# EAGLE design V0.2 (EAGLE 8.6.2)

## Sheet 1 of 4
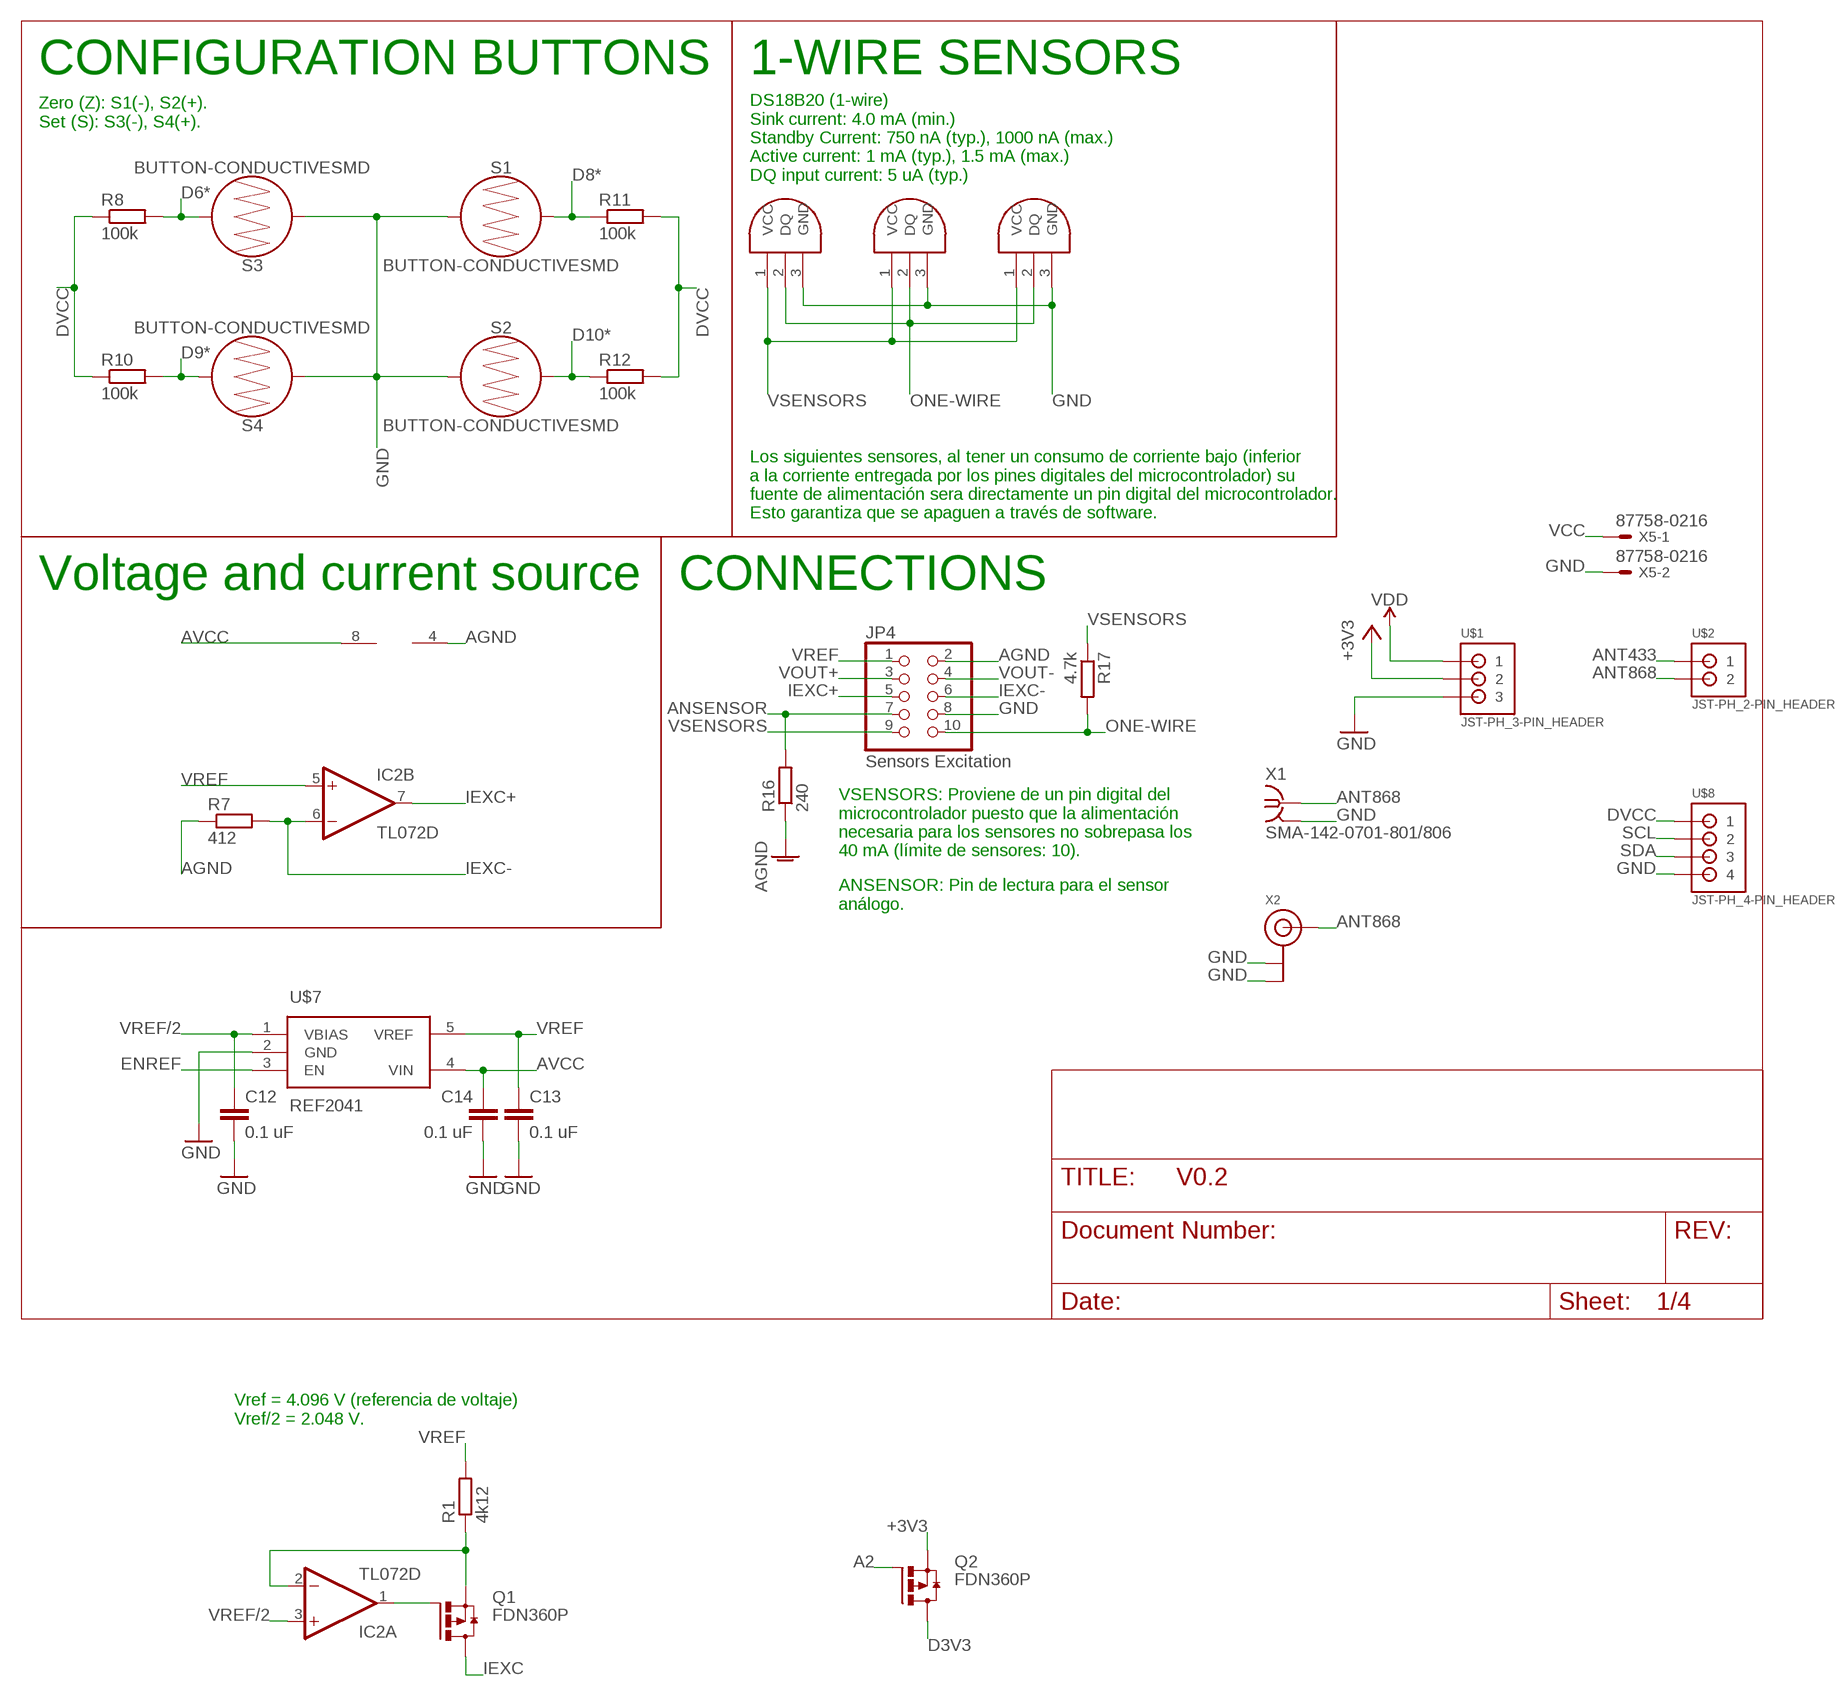
[diagram p0: schematic, sheet 1]

### Parts
C12  0.1 uF  C-EUC0805  [C0805]
C13  0.1 uF  C-EUC0805  [C0805]
C14  0.1 uF  C-EUC0805  [C0805]
IC2  TL072D  [SO08]
JP4  Sensors Excitation  PINHD-2X5/90  [2X05/90]
Q1  FDN360P  [SUPER-SOT3]
Q2  FDN360P  [SUPER-SOT3]
R1  4k12  R-EU_R0805  [R0805]
R7  412  R-EU_R0805  [R0805]
R8  100k  R-EU_R0805  [R0805]
R10  100k  R-EU_R0805  [R0805]
R11  100k  R-EU_R0805  [R0805]
R12  100k  R-EU_R0805  [R0805]
R16  240  R-EU_R0805  [R0805]
R17  4.7k  R-EU_R0805  [R0805]
S1  BUTTON-CONDUCTIVESMD  [BUTTON-CONDUCTIVE]
S2  BUTTON-CONDUCTIVESMD  [BUTTON-CONDUCTIVE]
S3  BUTTON-CONDUCTIVESMD  [BUTTON-CONDUCTIVE]
S4  BUTTON-CONDUCTIVESMD  [BUTTON-CONDUCTIVE]
U$1  JST-PH_3-PIN_HEADER  [JST_B3B-PH_HEADER]
U$2  JST-PH_2-PIN_HEADER  [JST_B2B-PH_HEADER]
U$5  DS18B20_PINS  [3PINS_SMALL]
U$6  DS18B20_PINS  [3PINS_SMALL]
U$7  REF2041  [SOT(5)]
U$8  JST-PH_4-PIN_HEADER  [JST_B4B-PH_HEADER]
U$9  DS18B20_PINS  [3PINS_SMALL]
X1  SMA-142-0701-801/806  [J502-ND-142-0701-801/806]
X2  ANTENNA_U.FL  [U.FL]
X5  87758-0216  [87758-0216]

### Nets
+3V3 [power]: Q2.2(S) U$1.P2 ; also sheet 2,3,4
A2: Q2.1(G) ; also sheet 2
AGND: IC2.4(P:V-) JP4.2 R7.1 R16.1 ; also sheet 4
ANSENSOR: JP4.7 R16.2 ; also sheet 2
ANT433: U$2.P1 ; also sheet 3
ANT868: U$2.P2 X1.1 X2.3(SIGNAL) ; also sheet 3
AVCC: C14.1 IC2.8(P:V+) U$7.4(VIN) ; also sheet 2,4
D3V3: Q2.3(D)
D6*: R8.2 S3.2 ; also sheet 2
D8*: R11.1 S1.2 ; also sheet 2
D9*: R10.2 S4.2 ; also sheet 2
D10*: R12.1 S2.2 ; also sheet 2
DVCC: R8.1 R10.1 R11.2 R12.2 U$8.P1 ; also sheet 2,3,4
ENREF: U$7.3(EN) ; also sheet 2
GND [power]: C12.2 C13.2 C14.2 JP4.8 S1.1 S2.1 S3.1 S4.1 U$1.P3 U$5.3(GND) U$6.3(GND) U$7.2(GND) U$8.P4 U$9.3(GND) X1.G@1 X1.G@2 X1.G@3 X1.G@4 X2.1(GND) X2.2(GND) X5.2 ; also sheet 2,3,4
IEXC: Q1.3(D)
IEXC+: IC2.7(B:OUT) JP4.5
IEXC-: IC2.6(B:-IN) JP4.6 R7.2
N$2: IC2.1(A:OUT) Q1.1(G)
ONE-WIRE: JP4.10 R17.2 U$5.2(DQ) U$6.2(DQ) U$9.2(DQ) ; also sheet 2
SCL: U$8.P2 ; also sheet 2
SDA: U$8.P3 ; also sheet 2
VCC [power]: X5.1 ; also sheet 4
VDD [power]: U$1.P1 ; also sheet 4
VEXC: IC2.2(A:-IN) Q1.2(S) R1.1
VOUT+: JP4.3 ; also sheet 2
VOUT-: JP4.4 ; also sheet 2
VREF: C13.1 IC2.5(B:+IN) JP4.1 R1.2 U$7.5(VREF)
VREF/2: C12.1 IC2.3(A:+IN) U$7.1(VBIAS)
VSENSORS: JP4.9 R17.1 U$5.1(VCC) U$6.1(VCC) U$9.1(VCC) ; also sheet 2

### Notes on the sheet
- CONFIGURATION BUTTONS | 1-WIRE SENSORS
- Zero (Z): S1(-), S2(+).
  Set (S): S3(-), S4(+).
- DS18B20 (1-wire)
  Sink current: 4.0 mA (min.)
  Standby Current: 750 nA (typ.), 1000 nA (max.)
  Active current: 1 mA (typ.), 1.5 mA (max.)
  DQ input current: 5 uA (typ.)
- Los siguientes sensores, al tener un consumo de corriente bajo (inferior 
  a la corriente entregada por los pines digitales del microcontrolador) su 
  fuente de alimentación sera directamente un pin digital del microcontrolador. 
  Esto garantiza que se apaguen a través de software.
- Voltage and current source | CONNECTIONS
- VSENSORS: Proviene de un pin digital del 
  microcontrolador puesto que la alimentación
  necesaria para los sensores no sobrepasa los 
  40 mA (límite de sensores: 10).
- ANSENSOR: Pin de lectura para el sensor 
  análogo.
- Vref = 4.096 V (referencia de voltaje)
  Vref/2 = 2.048 V.

## Sheet 2 of 4: This sheet contain all the configuration neccesary for microcontroller ATmega32u4. All conections about source, reset and external clocks was included here.
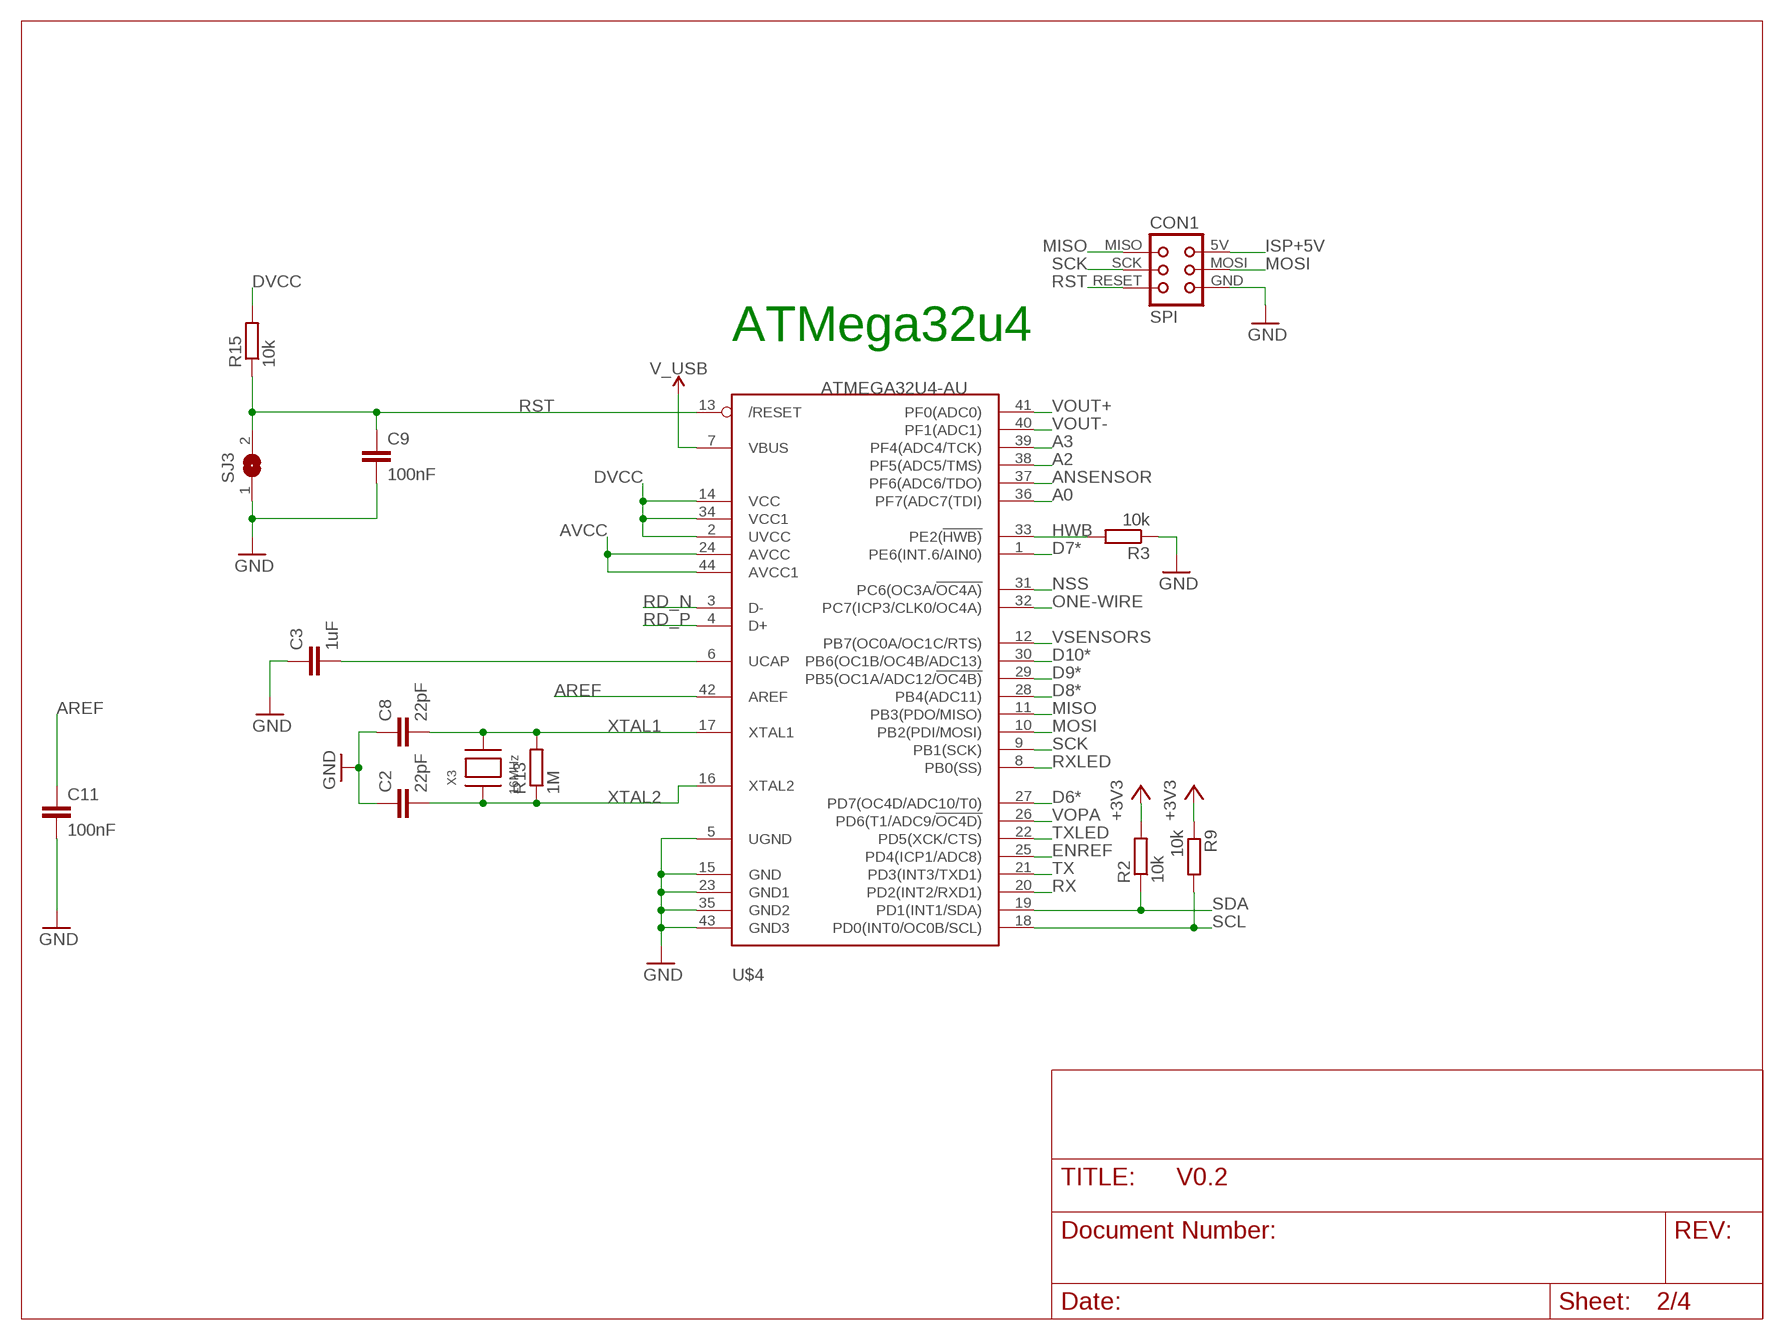
[diagram p1: schematic, sheet 2]

### Parts
C2  22pF  C-EUC1206  [C1206]
C3  1uF  C-EUC1206  [C1206]
C8  22pF  C-EUC1206  [C1206]
C9  100nF  C-EUC1206  [C1206]
C11  100nF  C-EUC1206  [C1206]
CON1  SPI  TINYISPT  [TC2030-MCP-NL]
R2  10k  R-EU_M1206  [M1206]
R3  10k  R-EU_M1206  [M1206]
R9  10k  R-EU_M1206  [M1206]
R13  1M  R-EU_R1206  [R1206]
R15  10k  R-EU_M0805  [M0805]
SJ3  SJ  [SJ]
U$4  ATMEGA32U4-AU  [TQFP44]
X3  16MHz  XTALNX6035  [NX6035]

### Nets
+3V3 [power]: R2.2 R9.1 ; also sheet 1,3,4
A0: U$4.36(PF7(ADC7(TDI))
A2: U$4.38(PF5(ADC5/TMS)) ; also sheet 1
A3: U$4.39(PF4(ADC4/TCK))
ANSENSOR: U$4.37(PF6(ADC6/TDO)) ; also sheet 1
AREF: C11.1 U$4.42(AREF)
AVCC: U$4.24(AVCC) U$4.44(AVCC1) ; also sheet 1,4
D6*: U$4.27(PD7(OC4D/ADC10/T0)) ; also sheet 1
D7*: U$4.1(PE6(INT.6/AIN0))
D8*: U$4.28(PB4(ADC11)) ; also sheet 1
D9*: U$4.29(PB5(OC1A/ADC12/!OC4B)) ; also sheet 1
D10*: U$4.30(PB6(OC1B/OC4B/ADC13)) ; also sheet 1
DVCC: R15.2 U$4.2(UVCC) U$4.14(VCC) U$4.34(VCC1) ; also sheet 1,3,4
ENREF: U$4.25(PD4(ICP1/ADC8)) ; also sheet 1
GND [power]: C2.1 C3.1 C8.1 C9.2 C11.2 CON1.GND R3.1 SJ3.1 U$4.5(UGND) U$4.15(GND) U$4.23(GND1) U$4.35(GND2) U$4.43(GND3) ; also sheet 1,3,4
HWB: R3.2 U$4.33(PE2(!HWB))
ISP+5V [power]: CON1.5V(VCC) ; also sheet 4
MISO: CON1.MISO U$4.11(PB3(PDO/MISO)) ; also sheet 3
MOSI: CON1.MOSI U$4.10(PB2(PDI/MOSI)) ; also sheet 3
NSS: U$4.31(PC6(OC3A/!OC4A)) ; also sheet 3
ONE-WIRE: U$4.32(PC7(ICP3/CLK0/OC4A)) ; also sheet 1
RD_N: U$4.3(D-) ; also sheet 4
RD_P: U$4.4(D+) ; also sheet 4
RST: C9.1 CON1.RESET R15.1 SJ3.2 U$4.13(/RESET) ; also sheet 3
RX: U$4.20(PD2(INT2/RXD1)) ; also sheet 3
RXLED: U$4.8(PB0(SS))
SCK: CON1.SCK U$4.9(PB1(SCK)) ; also sheet 3
SCL: R9.2 U$4.18(PD0(INT0/OC0B/SCL)) ; also sheet 1
SDA: R2.1 U$4.19(PD1(INT1/SDA)) ; also sheet 1
TX: U$4.21(PD3(INT3/TXD1)) ; also sheet 3
TXLED: U$4.22(PD5(XCK/CTS))
UCAP: C3.2 U$4.6(UCAP)
V_USB [power]: U$4.7(VBUS) ; also sheet 4
VOPA: U$4.26(PD6(T1/ADC9/!OC4D))
VOUT+: U$4.41(PF0(ADC0)) ; also sheet 1
VOUT-: U$4.40(PF1(ADC1)) ; also sheet 1
VSENSORS: U$4.12(PB7(OC0A/OC1C/RTS)) ; also sheet 1
XTAL1: C8.2 R13.2 U$4.17(XTAL1) X3.P$2
XTAL2: C2.2 R13.1 U$4.16(XTAL2) X3.P$1

### Notes on the sheet
- ATMega32u4

## Sheet 3 of 4
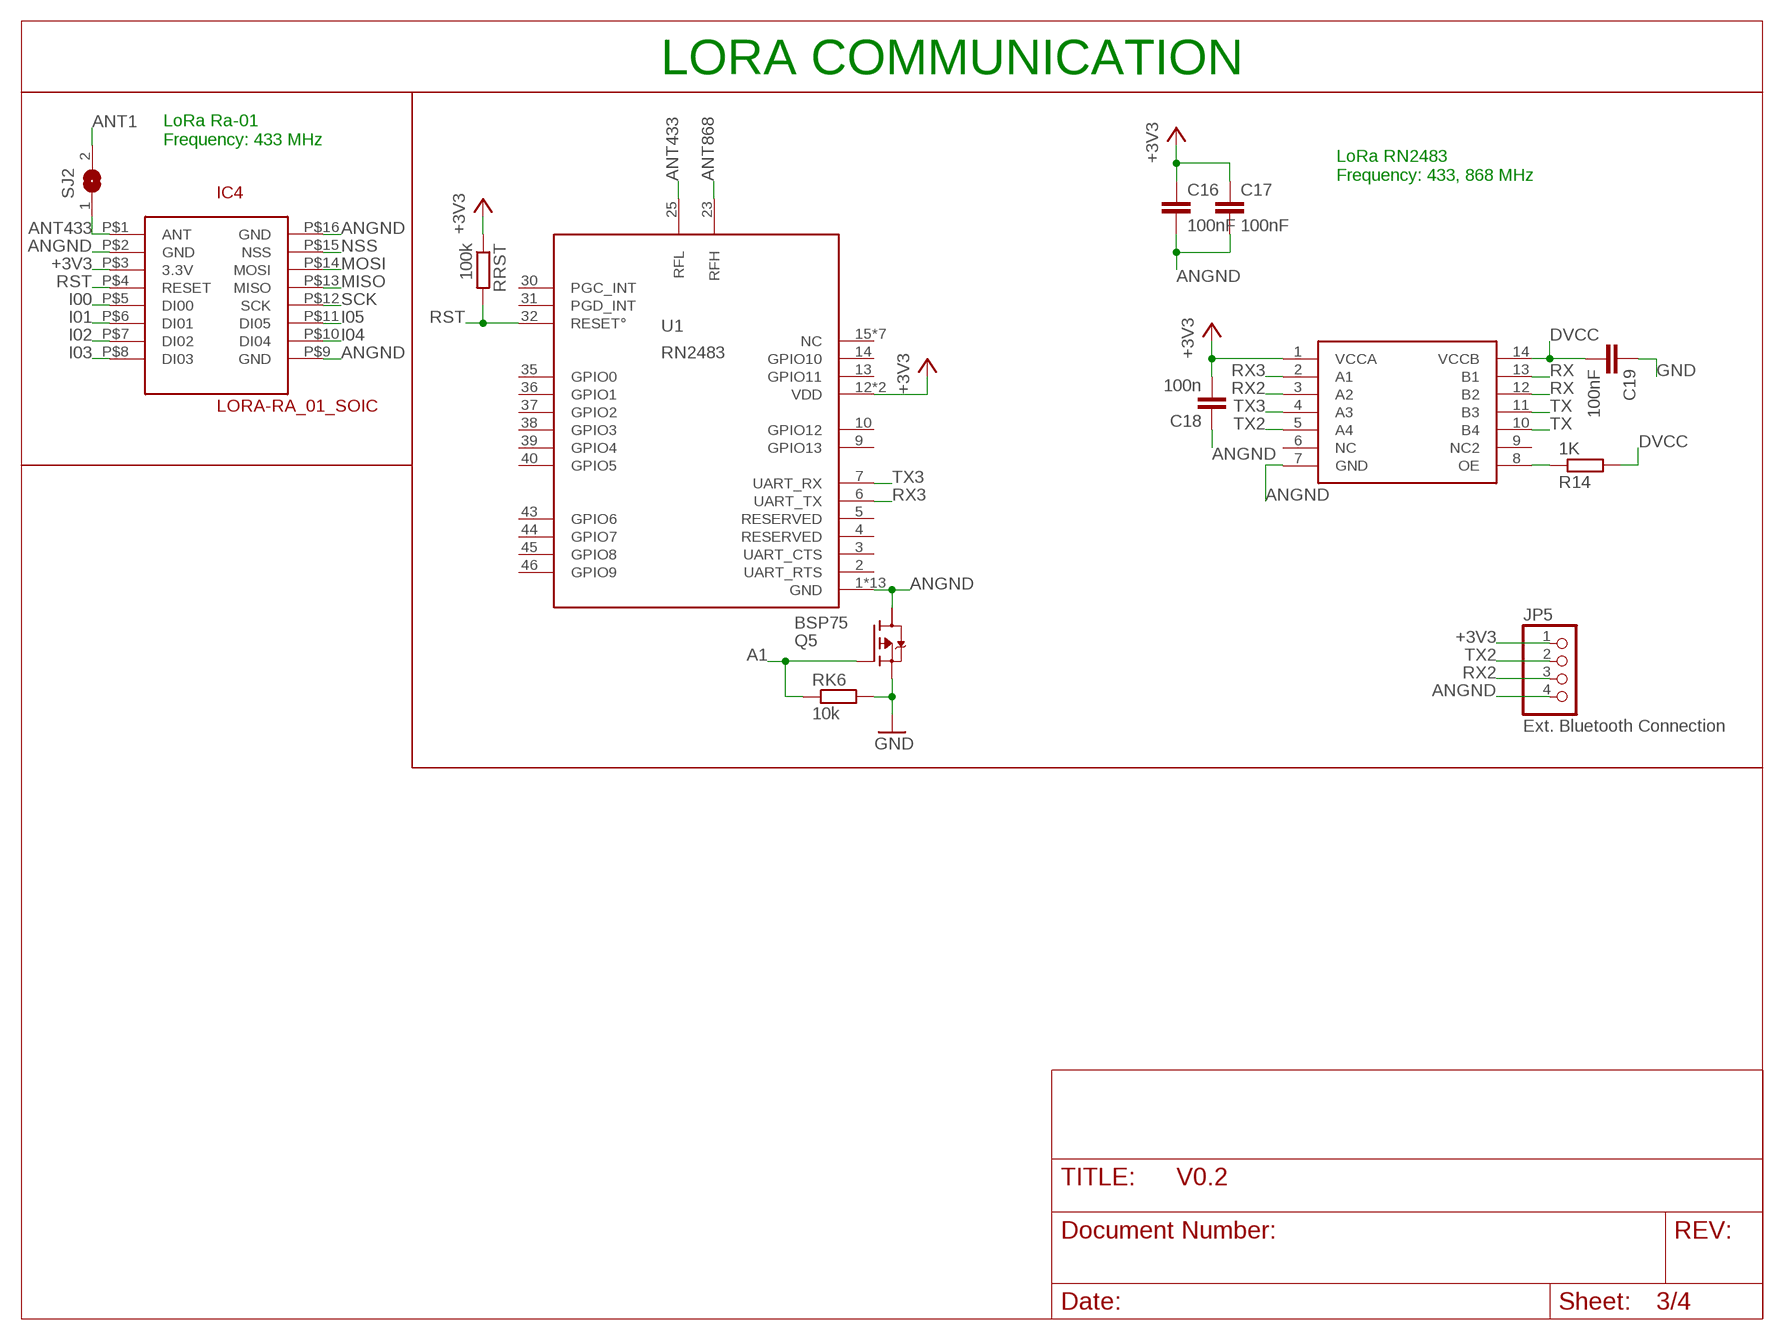
[diagram p2: schematic, sheet 3]

### Parts
C16  100nF  C-EUC1206  [C1206]
C17  100nF  C-EUC1206  [C1206]
C18  100n  C-EUC1206  [C1206]
C19  100nF  C-EUC1206  [C1206]
IC4  LORA-RA_01_SOIC  [LORA-RA_01]
JP5  Ext. Bluetooth Connection  PINHD-1X4  [1X04]
Q5  BSP75  BSP613P  [PG-SOT-223]
R14  1K  R-EU_R0805  [R0805]
RK6  10k  R-EU_M0805  [M0805]
RRST  100k  R-EU_R0805  [R0805]
SJ2  SJ  [SJ]
U1  RN2483  [RN2483]
U$3  TXB0104  [SO14]

### Nets
+3V3 [power]: C16.1 C17.1 C18.2 IC4.P$3(3.3V) JP5.1 RRST.1 U1.12(VDD) U1.34(VDD) U$3.1(VCCA) ; also sheet 1,2,4
A1: Q5.1(G) RK6.1
ANGND: C16.2 C17.2 C18.1 IC4.P$2(GND) IC4.P$9(GND) IC4.P$16(GND) JP5.4 Q5.2(D) U1.1(GND) U1.8(GND) U1.11(GND) U1.20(GND) U1.21(GND) U1.22(GND) U1.24(GND) U1.26(GND) U1.27(GND) U1.28(GND) U1.33(GND) U1.41(GND) U1.47(GND) U$3.7(GND)
ANT1: SJ2.2
ANT433: IC4.P$1(ANT) SJ2.1 U1.25(RFL) ; also sheet 1
ANT868: U1.23(RFH) ; also sheet 1
DVCC: C19.2 R14.2 U$3.14(VCCB) ; also sheet 1,2,4
GND [power]: C19.1 Q5.3(S) RK6.2 ; also sheet 1,2,4
I00: IC4.P$5(DI00)
I01: IC4.P$6(DI01)
I02: IC4.P$7(DI02)
I03: IC4.P$8(DI03)
I04: IC4.P$10(DI04)
I05: IC4.P$11(DI05)
MISO: IC4.P$13(MISO) ; also sheet 2
MOSI: IC4.P$14(MOSI) ; also sheet 2
N$3: R14.1 U$3.8(OE)
NSS: IC4.P$15(NSS) ; also sheet 2
RST: IC4.P$4(RESET) RRST.2 U1.32(RESET°) ; also sheet 2
RX: U$3.12(B2) U$3.13(B1) ; also sheet 2
RX2: JP5.3 U$3.3(A2)
RX3: U1.6(UART_TX) U$3.2(A1)
SCK: IC4.P$12(SCK) ; also sheet 2
TX: U$3.10(B4) U$3.11(B3) ; also sheet 2
TX2: JP5.2 U$3.5(A4)
TX3: U1.7(UART_RX) U$3.4(A3)
Unconnected: Q5.4(D) U1.2(UART_RTS) U1.3(UART_CTS) U1.4(RESERVED) U1.5(RESERVED) U1.9(GPIO13) U1.10(GPIO12) U1.13(GPIO11) U1.14(GPIO10) U1.15(NC) U1.16(NC) U1.17(NC) U1.18(NC) U1.19(NC) U1.29(NC) U1.30(PGC_INT) U1.31(PGD_INT) U1.35(GPIO0) U1.36(GPIO1) U1.37(GPIO2) U1.38(GPIO3) U1.39(GPIO4) U1.40(GPIO5) U1.42(NC) U1.43(GPIO6) U1.44(GPIO7) U1.45(GPIO8) U1.46(GPIO9) U$3.6(NC) U$3.9(NC2)

### Notes on the sheet
- LORA COMMUNICATION
- LoRa Ra-01
  Frequency: 433 MHz
- LoRa RN2483
  Frequency: 433, 868 MHz

## Sheet 4 of 4
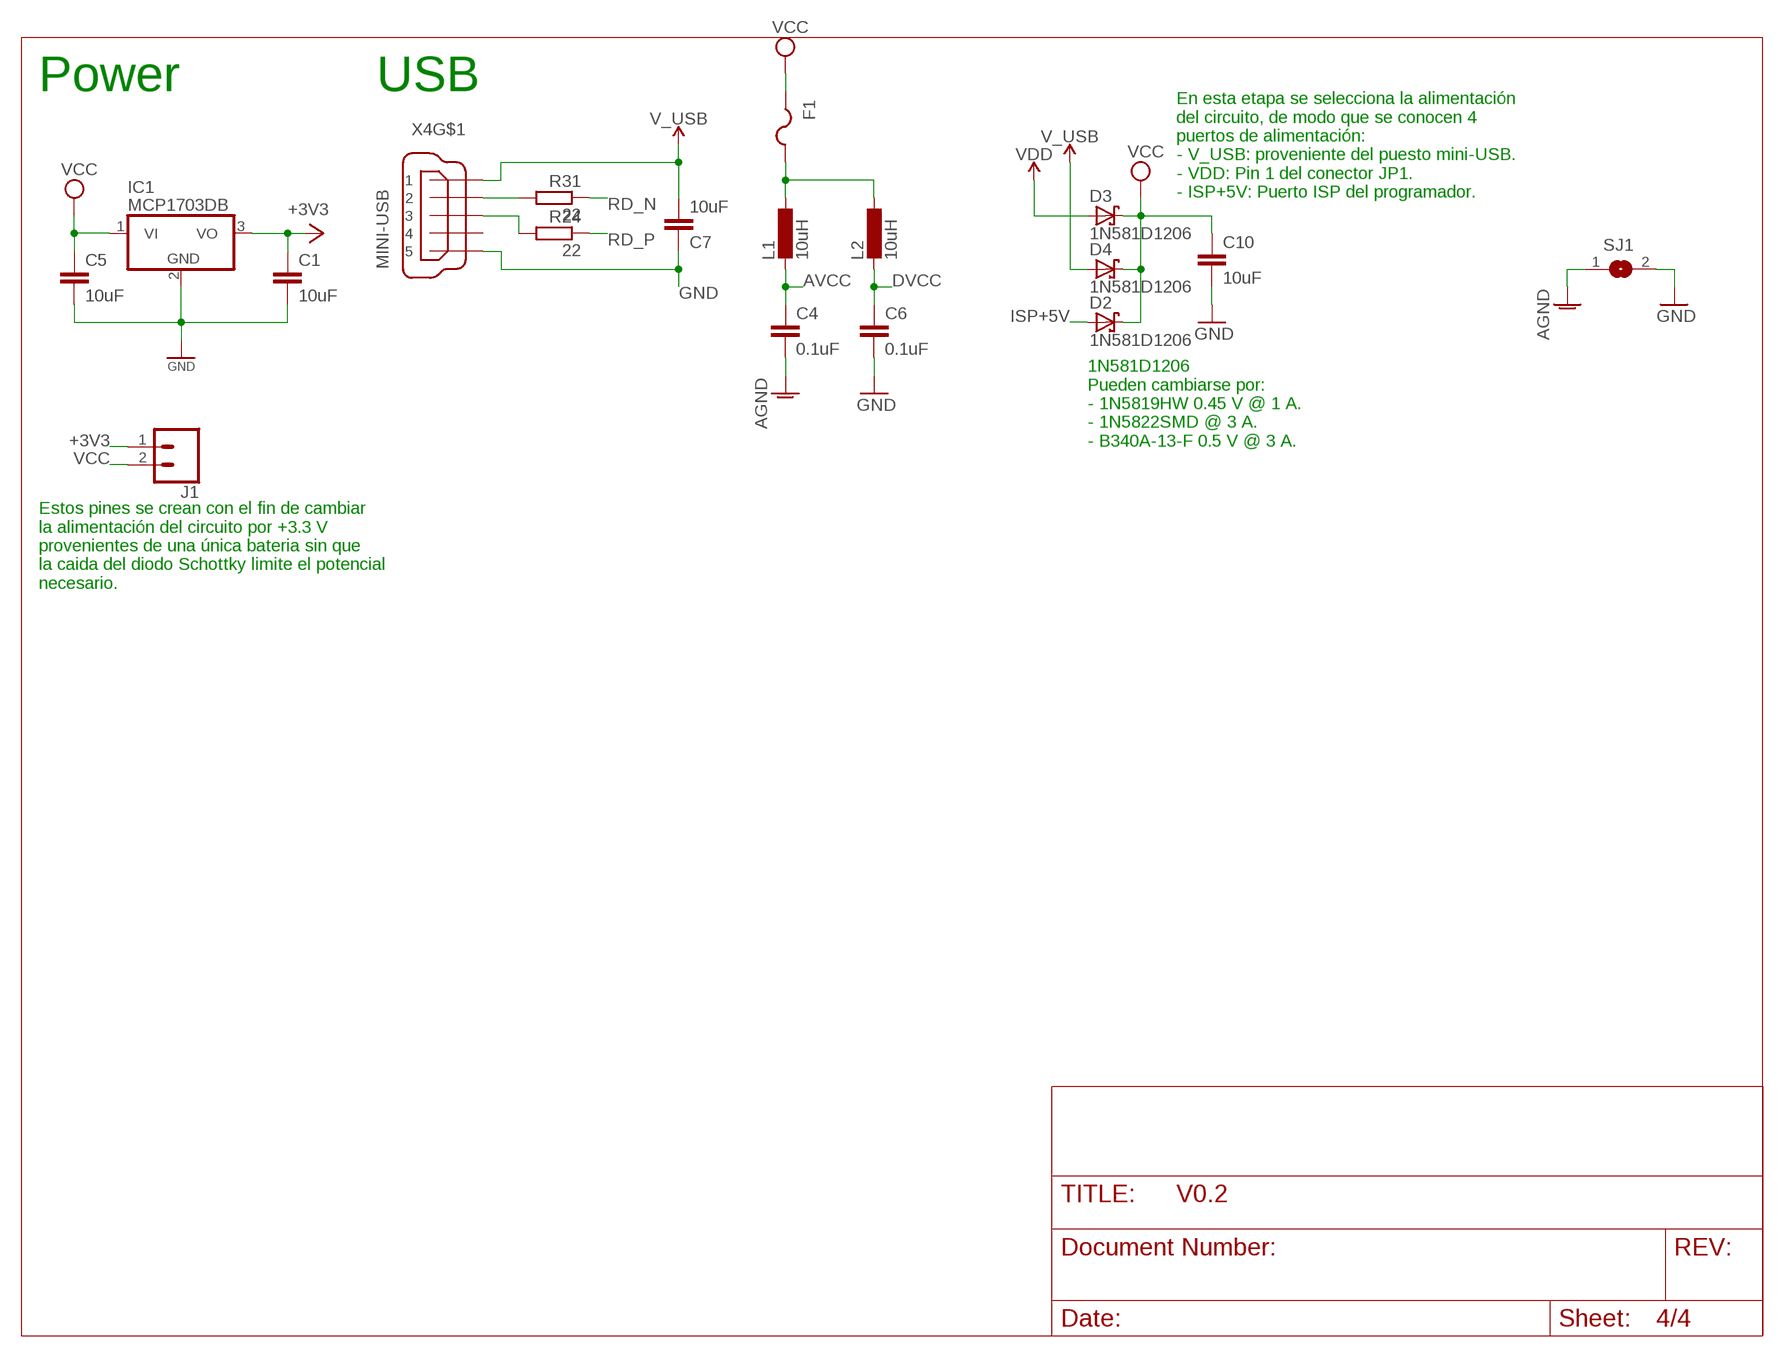
[diagram p3: schematic, sheet 4]

### Parts
C1  10uF  C-EUC1206  [C1206]
C4  0.1uF  C-EUC0805  [C0805]
C5  10uF  C-EUC1206  [C1206]
C6  0.1uF  C-EUC0805  [C0805]
C7  10uF  C-EUC1206  [C1206]
C10  10uF  C-EUC1206  [C1206]
D2  1N581D1206  [LED-1206]
D3  1N581D1206  [LED-1206]
D4  1N581D1206  [LED-1206]
F1  PTCFUSE-1812  [1812]
IC1  MCP1703DB  [SOT223]
J1  CONN_02  [1X02]
L1  10uH  L-EUL1812  [L1812]
L2  10uH  L-EUL1812  [L1812]
R24  22  R-EU_R0805  [R0805]
R31  22  R-EU_R0805  [R0805]
SJ1  SJ  [SJ]
X4  MINI-USB  MINI-USB-SCHIELD-32005-201  [32005-201]

### Nets
+3V3 [power]: C1.1 IC1.3(VO) J1.1 ; also sheet 1,2,3
AGND: C4.2 SJ1.1 ; also sheet 1
AVCC: C4.1 L1.2 ; also sheet 1,2
D+USB: R24.2 X4.3
D-USB: R31.2 X4.2
DVCC: C6.1 L2.2 ; also sheet 1,2,3
GND [power]: C1.2 C5.2 C6.2 C7.1 C10.2 IC1.2(GND) SJ1.2 X4.5 ; also sheet 1,2,3
ISP+5V [power]: D2.A ; also sheet 2
N$1 [power]: F1.2 L1.1 L2.1
RD_N: R31.1 ; also sheet 2
RD_P: R24.1 ; also sheet 2
V_USB [power]: C7.2 D4.A X4.1 ; also sheet 2
VCC [power]: C5.1 C10.1 D2.C D3.C D4.C F1.1 IC1.1(VI) J1.2 ; also sheet 1
VDD [power]: D3.A ; also sheet 1
Unconnected: X4.4 X4.M1(S:S1) X4.M2(S:S2) X4.M3(S:S3) X4.M4(S:S4)

### Notes on the sheet
- Power | USB
- En esta etapa se selecciona la alimentación 
  del circuito, de modo que se conocen 4
  puertos de alimentación:
  - V_USB: proveniente del puesto mini-USB.
  - VDD: Pin 1 del conector JP1.
  - ISP+5V: Puerto ISP del programador.
- 1N581D1206
  Pueden cambiarse por:
  - 1N5819HW 0.45 V @ 1 A.
  - 1N5822SMD @ 3 A.
  - B340A-13-F 0.5 V @ 3 A.
- Estos pines se crean con el fin de cambiar 
  la alimentación del circuito por +3.3 V 
  provenientes de una única bateria sin que 
  la caida del diodo Schottky limite el potencial 
  necesario.

## Library data of the parts
C1-C3 C5 C7-C11 C16-C19 = rcl:C-EU: CAPACITOR, European symbol
C4 C6 C12-C14 = rcl:C-EU: CAPACITOR, European symbol; SPICEPREFIX: C
CON1 = lpatiny:TINYISP: CONNECTOR
D2-D4 = lpatiny:1N581*: 1.0A SCHOTTKY BARRIER RECTIFIER Source: http://www.diodes.com/datasheets/ds23001.pdf
F1 = adafruit:PTCFUSE: PTC fuses, resettable thermistors
IC1 = linear:MCP1703: 250 mA, 16V, Low Quiescent Current LDO Regulator Source: http://ww1.microchip.com/downloads/en/DeviceDoc/22049b.pdf
IC2 = linear:TL072: OP AMP; SPICEPREFIX: J
IC4 = LORA-RA_01:LORA-RA_01_SOIC
J1 = SparkFun-Connectors:CONN_02: Multi connection point. Often used as Generic Header-pin footprint for 0.1 inch spaced/style header connections On any of the 0.1 inch spaced packages, you can populate with these: Break Away Headers - Straight <https://www.sparkfun.com/products/116> (PRT-00116) Break Away Male Headers - Right Angle <https://www.sparkfun.com/products/553> (PRT-00553) Female Headers <https://www.sparkfun.com/products/115> (PRT-00115) Break Away Headers - Machine Pin <https://www.sparkfun.com/products/117> (PRT-00117) Break Away Female Headers - Swiss Machine Pin <https://www.sparkfun.com/products/743> (PRT-00743) For SCREWTERMINALS and SPRING TERMINALS visit here: Screw Terimnals on SparkFun.com <https://www.sparkfun.com/search/results?term=Screw+Terminals> (5mm/3.5mm/2.54mm spacing) This device is also useful as a general connection point to wire up your design to another part of your project. Our various solder wires solder well into these plated through hole pads. Hook-Up Wire - Assortment (Stranded, 22 AWG) <https://www.sparkfun.com/products/11375> (PRT-11375) Hook-Up Wire - Assortment (Solid Core, 22 AWG) <https://www.sparkfun.com/products/11367> (PRT-11367) View the entire wire category on our website here <https://www.sparkfun.com/categories/141> Special notes: Molex polarized connector foot print use with: PRT-08233 with associated crimp pins and housings. 2.54_SCREWTERM for use with PRT-10571. 3.5mm Screw Terminal footprints for PRT-08084 5mm Screw Terminal footprints for use with PRT-08432
JP4 = pinhead:PINHD-2X5: PIN HEADER
JP5 = pinhead:PINHD-1X4: PIN HEADER
L1 L2 = rcl:L-EU: INDUCTOR, European symbol; SPICEPREFIX: L
Q1 Q2 = transistor-power:FDN360P: Single P-Channel, PowerTrench (R) MOSFET Source: http://www.fairchildsemi.com/ds/FD/FDN360P.pdf
Q5 = infineon:BSP613P: SIPMOS (R) Small-Signal-Transistor P-Channel (2 Drain) Source: http://www.infineon.com/dgdl/BSP613P_Rev2.4.pdf; OC_FARNELL: unknown; OC_NEWARK: unknown
R1 R7 R8 R10-R12 R16 R17 R24 R31 = rcl:R-EU_: RESISTOR, European symbol; SPICEPREFIX: R
R2 R3 R9 R15 RK6 = resistor:R-EU_: RESISTOR, European symbol
R13 R14 RRST = rcl:R-EU_: RESISTOR, European symbol
S1-S4 = SparkFun-Switches:BUTTON-CONDUCTIVE: Conductive Button Used with rubber key pads on the Nordic Key FOB <https://www.sparkfun.com/products/retired/8602>. This one was designed and proven to work with the PolyCase Key FOB enclosures <https://www.sparkfun.com/products/retired/9377>. SparkFun Products Nordic Fob <https://www.sparkfun.com/products/retired/8602> (WRL-08602)
SJ1-SJ3 = jumper:SJ: SMD solder JUMPER
U1 = tobias:RN2483: RN2483 Microchip Low-Power Lora Transceiver Module NOT TESTED There are testpads on the bottom of the device. The mask is supposed to cover that, but I have not tested it in practice yet. Info: http://www.microchip.com/wwwproducts/Devices.aspx?product=RN2483 Datasheet: http://ww1.microchip.com/downloads/en/DeviceDoc/50002346B.pdf Adapted from: https://github.com/Octanis1/Octanis1-Electronics/blob/ae493cac28c100e20856abe563dfe8824e9cc4bd/lib/Octanis1.lbr
U$1 = SRG:JST-PH_3-PIN_HEADER: 3-pin JST PH Shrouded Header, top entry P/N B3B-PH-K-S Mating connector PHR-3
U$2 = SRG:JST-PH_2-PIN_HEADER: 2-pin JST PH Shrouded Header, top entry P/N B2B-PH-K-S Mating connector PHR-2 Mating cable assembly: Sparkfun PRT-09914 <http://www.sparkfun.com/products/9914>
U$3 = lpatiny:TXB0104: TXB0104 4-Bit Bidirectional Voltage-level Translator With Automatic Direction Sensing and ±15-kV ESD Protection
U$4 = adafruit:ATMEGA32U4: http://www.ladyada.net/library/eagle
U$5 U$6 U$9 = lpatiny:DS18B20_PINS
U$7 = ref2041:REF2041
U$8 = SRG:JST-PH_4-PIN_HEADER: 4-pin JST PH Shrouded Header, top entry P/N B4B-PH-K-S Mating connector PHR-4 Mating cable assembly: Sparkfun PRT-09916 <http://www.sparkfun.com/products/9916>
X1 = con-coax:SMA-: SMA 50 Ohm End Launch Jack Receptacle - Round Contact Johnson Components Source: www.johnsoncomponents.com .. J502-ND.pdf; MF: JOHNSON COMPONENTS; MPN: 142-0701-801; OC_FARNELL: 1608592; OC_NEWARK: 90F2624
X2 = adafruit:ANTENNA_U.FL: U.FL Antenna Connector
X3 = lpatiny:XTAL: Low cost SMT crystals, no capacitors included http://www.ladyada.net/library/eagle
X4 = con-cypressindustries:MINI-USB-SCHIELD-: MINI USB-B Conector Source: www.cypressindustries.com; OC_FARNELL: unknown; OC_NEWARK: unknown
X5 = con-molex:87758-0216: 2 Pin - 2mm Dual Row Single Wafer, Vertical T/H HDR Source: http://www.molex.com/pdm_docs/sd/877580616_sd.pdf; MF: MOLEX; MPN: 87758-0216; OC_FARNELL: unknown; OC_NEWARK: 94M1513

## Net classes
0 default: width 0.203 mm
1 power: width 0.203 mm, drill 0.305 mm, clearance 0.152 mm
2 VIN: width 0.457 mm
3 fine: width 0.305 mm
4 aref: width 0.305 mm

## Board
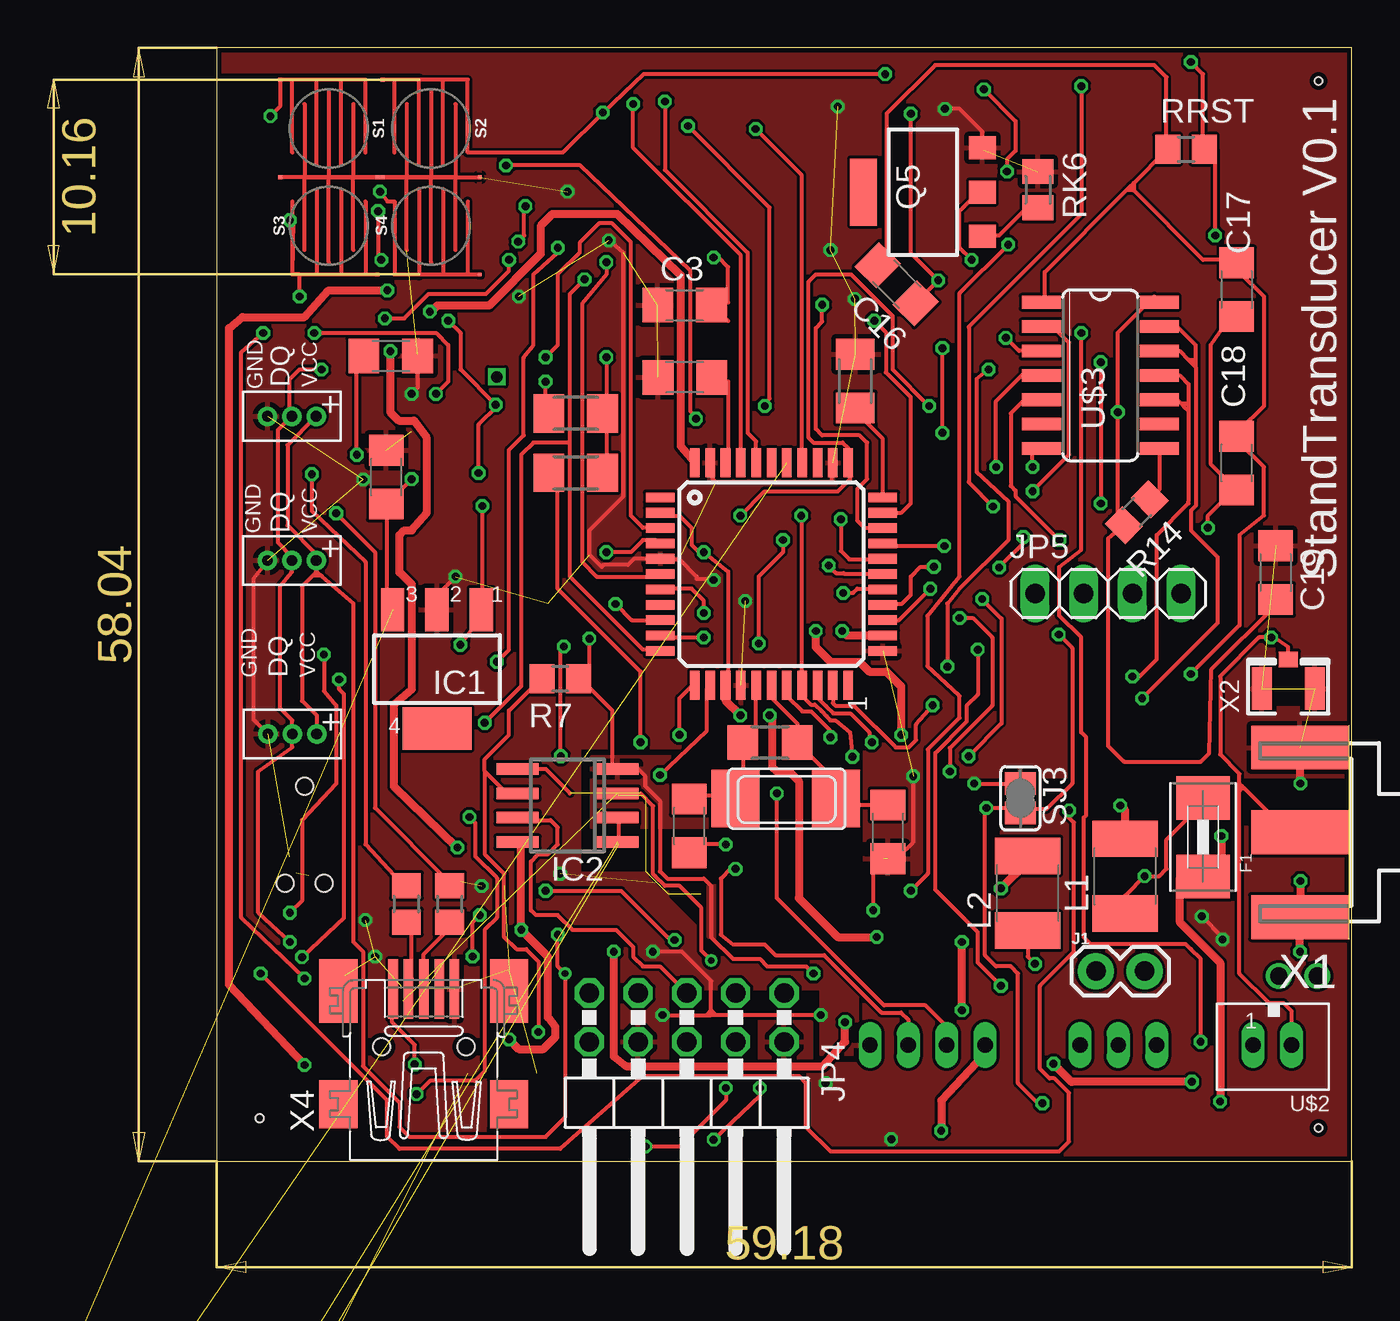
[diagram p4: board, top side]
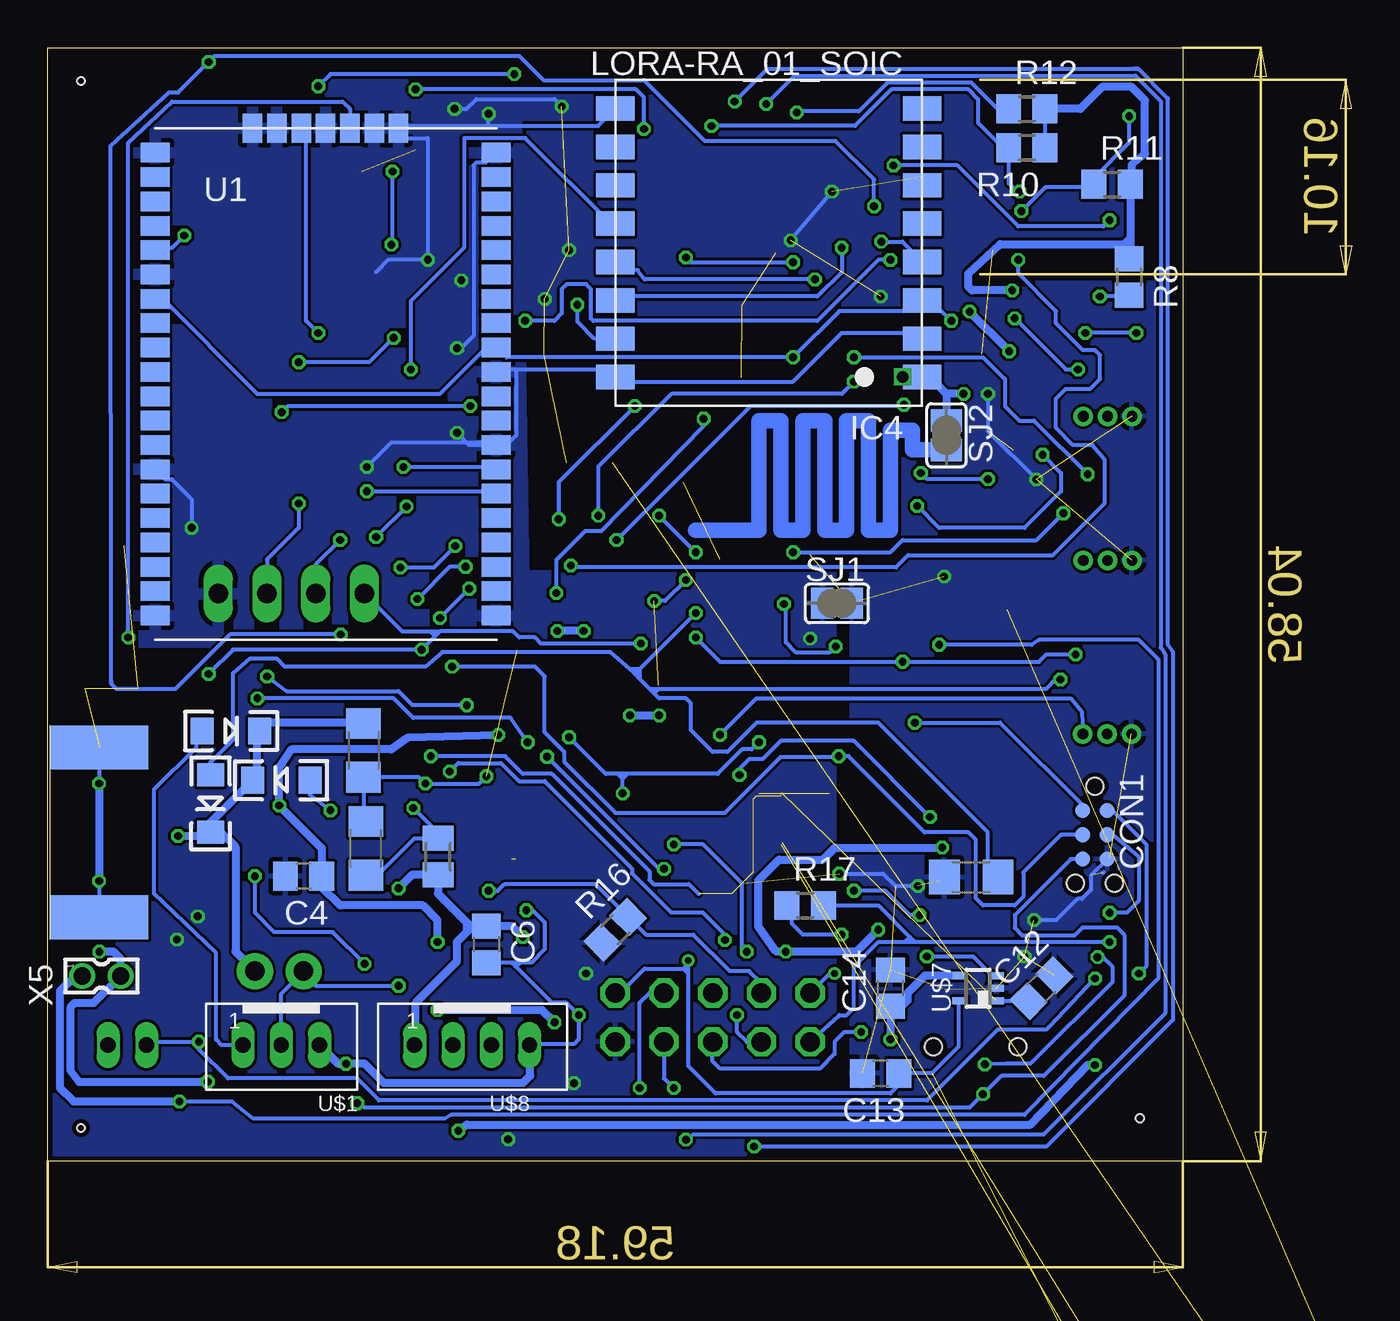
[diagram p5: board, bottom side, seen from below]

Size 59.18 x 58.04 mm. Coordinates in mm from the lower left corner, seen from the top.
Outline: 0,0 59.18,0 59.18,58.04 0,58.04 0,0
Copper layers (1*16): Top 0.035mm / dielectric 1.5mm / Bottom 0.035mm
Design rules "Fusion_eagle_rule_v1.1 *": minimum track width 8mil, minimum drill 16mil, track to track 6mil, track to pad 6mil, pad to pad 6mil, via to via 6mil, smd to smd 0mil, copper to edge 10mil, drill to drill 10mil, minimum pad ring 6mil, minimum via ring 6mil, stop-mask expansion 2mil, vias tented up to drill 100mil, thermal gap 10mil
Holes 0.41 mm at 57.45,1.73 2.24,2.24 57.45,56.31
vRestrict: area 21.2,23.6 to 36.4,26.4; area 0,13.2 to 8.9,20.8; area 21.2,34.5 to 36.4,38; area 33,22.8 to 36.6,38; area 21.2,22.8 to 24.8,38

### Footprints (pad centres in the part's own frame; a part is rotated, then mirrored left to right if it is on the bottom)
C1206 = smd 1.6 x 1.8: 1 -1.4,0; 2 1.4,0
C0805 = smd 1.3 x 1.5: 1 -0.95,0; 2 0.95,0
TC2030-MCP-NL = smd 0.787 x 0.787: 5V 1.27,0.635; GND 3.81,0.635; MISO 1.27,-0.635; MOSI 2.54,0.635; RESET 3.81,-0.635; SCK 2.54,-0.635 | hole 0.889: 0,0; 5.08,-1.016; 5.08,1.016
LED-1206 = smd 1.2 x 1.4: A -1.5,0; C 1.5,0
1812 = smd 2.286 x 2.794: 1 -2.046,0; 2 2.046,0
SOT223 = smd 1.219 x 2.235: 1 -2.311,-3.099; 2 0,-3.099; 3 2.311,-3.099 | smd 3.6 x 2.2: 4 0,3.099
SO08 = smd 0.6 x 2.2: 1 -1.905,-2.6; 2 -0.635,-2.6; 3 0.635,-2.6; 4 1.905,-2.6; 5 1.905,2.6; 6 0.635,2.6; 7 -0.635,2.6; 8 -1.905,2.6
LORA-RA_01 = smd 2 x 1.27: P$1 -8,7; P$2 -8,5; P$3 -8,3; P$4 -8,1; P$5 -8,-1; P$6 -8,-3; P$7 -8,-5; P$8 -8,-7; P$9 8,-7; P$10 8,-5; P$11 8,-3; P$12 8,-1; P$13 8,1; P$14 8,3; P$15 8,5; P$16 8,7 | drill 0.6 square: P$17 -6.985,6.985
1X02 = drill 1.016 pad 1.88: 1 0,0; 2 2.54,0
2X05/90 = drill 1.016 octagon: 1 -5.08,-6.35; 2 -5.08,-3.81; 3 -2.54,-6.35; 4 -2.54,-3.81; 5 0,-6.35; 6 0,-3.81; 7 2.54,-6.35; 8 2.54,-3.81; 9 5.08,-6.35; 10 5.08,-3.81
1X04 = drill 1.016 long: 1 -3.81,0; 2 -1.27,0; 3 1.27,0; 4 3.81,0
L1812 = smd 1.9 x 3.4: 1 -1.95,0; 2 1.95,0
SUPER-SOT3 = smd 1 x 1.4: 1 -0.95,-1.1; 2 0.95,-1.1; 3 0,1.1
PG-SOT-223 = smd 1.2 x 1.4: 1 -2.311,-3.099; 2 0,-3.099; 3 2.311,-3.099 | smd 3.5 x 1.4: 4 0,3.099
R0805 = smd 1.3 x 1.5: 1 -0.95,0; 2 0.95,0
M1206 = smd 1.6 x 2: 1 -1.4,0; 2 1.4,0
R1206 = smd 1.6 x 1.803: 1 -1.422,0; 2 1.422,0
M0805 = smd 1.3 x 1.6: 1 -0.95,0; 2 0.95,0
BUTTON-CONDUCTIVE = smd 0.203 x 0.203: 1 2.54,2.54; 2 2.54,-2.54
SJ = smd 1.168 x 1.6: 1 -0.762,0; 2 0.762,0
RN2483 = smd 1.524 x 1.016: 1 17.78,1.27; 2 17.78,2.54; 3 17.78,3.81; 4 17.78,5.08; 5 17.78,6.35; 6 17.78,7.62; 7 17.78,8.89; 8 17.78,10.16; 9 17.78,11.43; 10 17.78,12.7; 11 17.78,13.97; 12 17.78,15.24; 13 17.78,16.51; 14 17.78,17.78; 15 17.78,19.05; 16 17.78,20.32; 17 17.78,21.59; 18 17.78,22.86; 19 17.78,24.13; 20 17.78,25.4; 28 0,25.4; 29 0,24.13; 30 0,22.86; 31 0,21.59; 32 0,20.32; 33 0,19.05; 34 0,17.78; 35 0,16.51; 36 0,15.24; 37 0,13.97; 38 0,12.7; 39 0,11.43; 40 0,10.16; 41 0,8.89; 42 0,7.62; 43 0,6.35; 44 0,5.08; 45 0,3.81; 46 0,2.54; 47 0,1.27 | smd 1.016 x 1.524: 21 12.7,26.67; 22 11.43,26.67; 23 10.16,26.67; 24 8.89,26.67; 25 7.62,26.67; 26 6.35,26.67; 27 5.08,26.67
JST_B3B-PH_HEADER = drill 0.8 long: P1 2.027,0.048; P2 0.028,0.048; P3 -1.972,0.048
JST_B2B-PH_HEADER = drill 0.8 long: P1 1.075,0.048; P2 -0.925,0.048
SO14 = smd 0.66 x 2.032: 1 -3.81,-3.073; 2 -2.54,-3.073; 3 -1.27,-3.073; 4 0,-3.073; 5 1.27,-3.073; 6 2.54,-3.073; 7 3.81,-3.073; 8 3.81,3.073; 9 2.54,3.073; 10 1.27,3.073; 11 0,3.073; 12 -1.27,3.073; 13 -2.54,3.073; 14 -3.81,3.073
TQFP44 = smd 1.5 x 0.5: 1 -5.8,4; 2 -5.8,3.2; 3 -5.8,2.4; 4 -5.8,1.6; 5 -5.8,0.8; 6 -5.8,0; 7 -5.8,-0.8; 8 -5.8,-1.6; 9 -5.8,-2.4; 10 -5.8,-3.2; 11 -5.8,-4; 23 5.8,-4; 24 5.8,-3.2; 25 5.8,-2.4; 26 5.8,-1.6; 27 5.8,-0.8; 28 5.8,0; 29 5.8,0.8; 30 5.8,1.6; 31 5.8,2.4; 32 5.8,3.2; 33 5.8,4 | smd 0.5 x 1.5: 12 -4,-5.8; 13 -3.2,-5.8; 14 -2.4,-5.8; 15 -1.6,-5.8; 16 -0.8,-5.8; 17 0,-5.8; 18 0.8,-5.8; 19 1.6,-5.8; 20 2.4,-5.8; 21 3.2,-5.8; 22 4,-5.8; 34 4,5.8; 35 3.2,5.8; 36 2.4,5.8; 37 1.6,5.8; 38 0.8,5.8; 39 0,5.8; 40 -0.8,5.8; 41 -1.6,5.8; 42 -2.4,5.8; 43 -3.2,5.8; 44 -4,5.8
3PINS_SMALL = drill 0.559 pad 1.016: 1 -1.27,0; 2 0,0; 3 1.27,0
SOT(5) = smd 0.35 x 0.8: 1 -0.65,-0.95; 2 0,-0.95; 3 0.65,-0.95; 4 0.65,0.95; 5 -0.65,0.95
JST_B4B-PH_HEADER = drill 0.8 long: P1 2.98,0.048; P2 0.98,0.048; P3 -1.02,0.048; P4 -3.02,0.048
J502-ND-142-0701-801/806 = smd 5.08 x 2.286: 1 2.565,0; G@1 2.565,4.42; G@2 2.565,-4.42 | smd 5.08 x 2.286 bottom: G@3 2.565,4.42; G@4 2.565,-4.42
U.FL = smd 2.2 x 1.05: 1 0,1.375; 2 0,-1.375 | smd 0.8 x 1: 3 1.525,0
NX6035 = smd 2.5 x 3: P$1 2.665,0; P$2 -2.565,0
32005-201 = smd 3.1 x 0.5: 1 3,1.6; 2 3,0.8; 3 3,0; 4 3,-0.8; 5 3,-1.6 | smd 2.5 x 2: M1 -3,-4.45; M2 -3,4.45 | smd 3.3 x 2: M3 2.9,4.45; M4 2.9,-4.45 | hole 0.9: 0,2.2; 0,-2.2
87758-0216 = drill 0.9 pad 1.27: 1 0,-1; 2 0,1

### Placement (x,y rotation side)
C1  8.84,35.66 90 top
C2  24.64,17.48 90 top
C3  24.4,44.63 0 top
C4  45.85,14.86 180 bottom
C5  9.07,41.99 0 top
C6  36.32,11.3 270 bottom
C7  11.02,14.81 0 bottom
C8  35,17.17 90 top
C9  42.6,16.31 90 bottom
C10  42.72,21.41 270 bottom
C11  24.41,40.87 180 top
C12  7.37,9.02 45 bottom
C13  15.75,4.57 180 bottom
C14  15.24,9.02 90 bottom
C16  35.46,45.72 315 top
C17  53.19,45.44 270 top
C18  53.19,36.4 90 top
C19  55.22,30.68 270 top
CON1  4.57,19.56 270 bottom
D2  47.02,19.86 180 bottom
D3  49.63,22.43 0 bottom
D4  50.7,18.64 270 bottom
F1  51.44,16.89 90 top
IC1  11.48,25.65 180 top
IC2  18.29,18.54 90 top
IC4  21.59,47.88 180 bottom
J1  45.85,9.91 0 top
JP4  24.51,2.41 180 top
JP5  46.48,29.59 0 top
L1  47.37,14.86 90 top
L2  42.29,13.97 90 top
Q1  -12.95,-38.48 0 top  (outside the outline)
Q2  -20.95,-37.59 0 top  (outside the outline)
Q5  36.83,50.52 90 top
R1  -13.21,-45.34 0 top  (outside the outline)
R2  18.72,38.99 0 top
R3  33.3,40.67 270 top
R7  17.91,25.15 180 top
R8  2.79,46.1 270 bottom
R9  18.72,35.89 180 top
R10  8.13,52.83 180 bottom
R11  3.68,50.93 0 bottom
R12  8.13,54.86 0 bottom
R13  28.85,21.82 0 top
R14  47.98,33.83 225 top
R15  38.84,15.88 270 bottom
R16  29.59,12.06 45 bottom
R17  19.68,13.34 0 bottom
R24  12.14,13.41 270 top
R31  9.88,13.41 270 top
RK6  42.82,50.65 90 top
RRST  50.55,52.76 0 top
S1  5.84,53.85 180 top
S2  11.18,53.85 180 top
S3  5.84,48.77 0 top
S4  11.18,48.77 0 top
SJ1  18.03,29.08 0 bottom
SJ2  12.32,37.85 270 bottom
SJ3  41.91,18.92 270 top
U1  53.59,27.18 0 bottom
U$1  46.99,6.1 180 bottom
U$2  55.12,6.1 180 top
U$3  46.08,40.97 270 top
U$4  28.93,30.61 0 top
U$5  3.91,31.32 180 top
U$6  3.91,38.84 180 top
U$7  10.67,9.02 90 bottom
U$8  37.08,6.1 180 bottom
U$9  3.94,22.28 180 top
X1  59.05,17.14 180 top
X2  55.88,24.64 90 top
X3  29.72,18.9 180 top
X4  10.79,5.97 90 top
X5  56.39,9.65 270 bottom

### Tracks (layer width: path | path; a pad name or v marks a point on that pad's centre or on a via)
+3V3  (via drill 0.41)  (1 unrouted)
  Top 0.203: IC1.3 8.89,29.21 8.89,33.66 C1.1 8.89,34.29 v10.16,35.56 | R9.1 20.32,36.2 20.32,38.73 R2.2 20.32,39.37 v20.32,41.91 | v40.89,9.14 39.69,10.35 39.69,11.94 37.47,14.16 37.47,21.27 39.1,22.91 39.1,23.74 39.69,24.32 v39.69,26.67 39.69,26.48 | v28.26,26.99 28.26,30.48 29.53,31.75 v29.53,32.38 | v13.65,35.88 13.65,38.42 14.61,39.37 v14.54,39.43 12.7,41.27 12.7,43.18 v12.06,43.81 | 47.43,50.61 43.18,46.35 43.18,45.09 U$3.1 | 47.43,50.61 47.62,50.8 | 47.62,50.8 47.82,50.99 | 47.82,50.99 49.53,52.7 RRST.1 49.53,53.34 49.53,56.52 48.9,57.15 37.47,57.15 34.92,54.61 34.92,47.17 C16.1 | 47.82,50.61 51.44,46.99 52.7,46.99 C17.1 53.34,46.35 54.61,45.09 54.61,39.37 53.34,38.1 C18.2 53.34,37.47 54.61,36.2 54.61,33.66 53.34,32.64 53.34,27.94 v50.8,25.4 | 47.82,50.61 47.62,50.8 | 47.82,50.99 47.82,50.61 | 47.82,50.61 47.43,50.61
  Bottom 0.203: 38.73,27.62 39.02,27.34 | 39.02,27.34 v39.69,26.67 49.53,26.67 v50.8,25.4 | 38.73,27.62 34.92,27.62 34.61,27.3 33.78,27.3 33.47,26.99 v28.26,26.99 | v29.53,32.38 22.54,39.37 14.61,39.37 v14.54,39.43 | v13.65,35.88 13.34,35.56 v10.16,35.56 | v12.06,43.81 12.7,44.45 13.34,44.45 IC4.P$3 13.97,44.32 17.91,44.32 v20.32,41.91 35.24,41.91 35.72,42.39 U1.12 36.2,42.55 38.73,40.01 48.26,40.01 53.34,45.09 U1.34 | JP5.1 40.7,27.62 39.24,27.62 | 39.24,27.62 38.73,27.62 | 39.24,27.62 39.02,27.4 39.02,27.34 | v40.89,9.14 45.21,9.14 J1.1 47.02,8.74 U$1.P2
A1
  Top 0.203: Q5.1 40.01,48.26 40.8,48.26 42.23,49.69 RK6.1
A2  (1 unrouted)
AGND  (via drill 0.41)
  Top 0.203: R7.1 19.05,25.08 20.64,23.5 20.64,20.64 IC2.4 21.97,20.45 22.35,20.07 22.35,19.56 23.11,18.8 23.11,15.11 23.5,14.73 25.4,14.73 25.78,14.35 25.78,11.68 26.92,10.54 28.32,10.54 28.7,10.16 30.73,10.16 v31.11,9.78 | 19.05,25.4 R7.1 | v51.37,12.76 52.45,11.68 v52.45,11.56 | R7.1 19.43,25.72 v19.43,27.24
  Bottom 0.203: 19.05,28.89 SJ1.1
  other vias: 35.18,1.14 31.75,4.06
  pour Bottom: 18.16,30.73 18.16,0 59.18,0 59.18,30.73
  pour Top: 25.65,0 25.65,5.08 28.32,5.08 28.32,8.51 30.99,8.51 30.99,5.08 33.78,5.08 33.78,11.68 25.65,11.68 25.65,14.35 39.62,14.35 39.62,16.64 40.39,16.64 43.31,19.56 48.01,19.56 49.66,17.91 50.29,17.91 59.18,16.64 59.18,0
  pour Top: 19.56,21.08 33.02,21.08 33.02,14.22 37.47,14.22 37.47,4.06 33.91,4.06 33.91,11.18 26.54,11.18 26.54,17.4 19.56,17.4
ANGND  (via drill 0.41)
  Top 0.203: C17.2 52.7,43.81 51.82,42.55 51.82,36.37 53.11,35.08 | v39.37,46.99 38.73,47.62 38.73,49.53 39.37,50.16 Q5.2 | v42.55,36.2 42.55,37.08 U$3.7 | v37.85,37.97 v37.85,42.39 | 53.11,35.08 C18.1 | v51.69,33.02 51.69,33.66 53.11,35.08 | C16.2 37.51,45.8 v37.62,45.92 36.2,47.35 v36.2,54.61
  Bottom 0.203: 34.77,41.27 35.56,41.27 U1.11 | 34.77,41.27 29.84,41.27 IC4.P$16 29.21,40.64 20.32,40.64 17.78,43.18 13.97,43.18 IC4.P$2 | 36.2,53.98 40.64,53.98 U1.21 40.64,53.34 39.37,53.34 v39.37,46.99 41.43,46.99 42.07,46.35 | 36.2,53.98 30.48,53.98 29.84,54.61 IC4.P$9 | v42.55,36.2 41.27,37.47 36.2,37.47 U1.8 | 36.2,53.98 v36.2,54.61 | 53.34,36.2 U1.41 | U1.41 | U1.20 35.88,52.55 36.35,52.07 36.83,52.07 36.99,51.91 36.99,43.02 37.62,42.39 v37.85,42.39 | U1.22 42.23,53.82 U1.22 | 34.77,41.27 34.77,37.85 35.27,37.34 U1.8 | 35.72,37.47 U1.8 | 47.45,53.85 47.62,53.98 U1.26 | U1.27 48.26,53.98 48.26,53.85 | U1.41 53.66,36.04 U1.41 | U1.26 47.31,53.82 47.31,53.98 U1.26 | U1.22 42.23,53.98 U1.22 | 35.88,28.42 35.81,28.42 | U1.1 | 35.88,28.42 U1.1 | U1.1 35.88,28.57 35.88,28.42 | U1.41 53.09,35.56 52.73,35.56 51.69,34.52 v51.69,33.02 | U1.8 37.21,37.34 v37.85,37.97
  pour Bottom: 34.29,26.92 34.8,57.02 55.12,57.02 55.12,27.05
ANSENSOR  (via drill 0.41)
  Top 0.203: v28.1,53.82 30.48,51.44 30.48,36.51 U$4.37 | v41.27,47.78 38.73,45.24 38.73,30.48 37.05,28.42 37.05,25.81 38.73,24.26 38.73,23.11 37.08,21.46 37.08,14.99 v36.2,14.1 | v40.01,55.88 41.66,54.23 41.66,52.67 41.21,52.23 v41.21,51.59
  Bottom 0.203: v28.1,53.82 28.1,55.47 28.51,55.88 v40.01,55.88 | v41.21,51.59 41.21,48.04 v41.27,47.78 | v36.2,14.1 35.72,14.1 35.39,14.43 35.35,14.43 35.34,14.45 30.63,14.45 R16.2 27.99,11.81 25.53,11.81 23.62,9.91 22.61,9.91 21.97,9.27 JP4.7
ANT1
  Bottom 0.813: SJ2.2 14.1,37.08 14.1,38.1 15.24,38.1 15.24,32.89 16.38,32.89 16.38,38.61 17.53,38.61 17.53,32.89 18.67,32.89 18.67,38.61 19.81,38.61 19.81,32.89 20.95,32.89 20.95,38.61 22.1,38.61 22.1,32.89 25.4,32.89
ANT433  (via drill 0.41)
  Top 0.203: v45.09,43.18 45.09,31.88 43.94,30.99 43.94,28.45 45.09,27.3 45.09,22.35 45.34,22.1 45.34,18.03 45.21,17.91 45.21,11.68 45.59,11.3 50.55,11.3 50.8,11.05 51.31,10.54 v51.31,6.22 | v11.43,40.01 12.06,40.64 12.06,42.55 11.43,43.18 v5.08,43.18 | v2.41,43.18 1.27,42.16 1.27,12.7 v4.57,9.53
  Bottom 0.203: U1.25 45.72,53.34 45.72,43.81 v45.09,43.18 | v2.41,43.18 v5.08,43.18 | v4.57,9.53 6.99,6.99 7.11,6.86 9.65,6.86 13.34,3.17 41.91,3.17 43.05,4.32 49.78,4.32 51.31,5.84 v51.31,6.22 53.87,6.22 U$2.P1
  Bottom 0.406: 13.19,40.88 12.32,40.01 | 12.32,40.01 SJ2.1 | v11.43,40.01 12.32,40.01
  Bottom 0.813: IC4.P$1 13.19,40.88
ANT868  (via drill 0.41)
  Top 0.203: X1.1 55.88,17.14 53.59,19.43 | X2.3 55.88,26.8 55.12,27.3 v54.99,27.3 54.36,27.3 52.32,25.27 52.32,21.21 53.34,20.19 53.34,19.68 | U$2.P2 56.04,7.84 55.63,8.26 54.86,8.26 53.34,9.78 53.34,19.3 | 53.34,19.3 53.34,19.56 | 53.34,19.56 53.34,19.68 | 53.59,19.43 53.47,19.56 | 53.47,19.56 53.34,19.56 | 53.34,19.3 53.47,19.43 53.59,19.43 | 53.34,19.68 53.47,19.56
  Bottom 0.203: v54.99,27.3 54.99,53.09 52.7,55.24 43.81,55.24 43.43,54.86 U1.23 43.81,53.98
AREF
  Top 0.203: U$4.42 26.67,36.83 26.67,40.64 C11.1
AVCC  (via drill 0.41)
  Top 0.203: 34.29,27.3 U$4.24
  Top 0.406: IC2.8 15.88,16.51 v15.88,12.06 17.27,10.67 17.27,7.49 17.65,6.99 17.65,6.48 17.02,5.84 15.75,5.84 v15.24,6.35 | v12.54,16.35 9.24,19.53 9.24,23.81 10.16,24.61 10.16,30.07 9.53,30.7 9.53,32.64 9.78,32.89 10.16,32.89 10.95,33.81 10.95,37.69 10.29,38.61 9.49,38.61 9.05,39.05 v9.05,42.23 | U$4.44 24.19,37.27 24.19,46.2 20.89,49.37 17.49,49.37 16.89,48.77 16.89,47.31 14.19,44.61 11.49,44.61 11.18,44.29 v11.11,44.29 | v20.7,10.92 20.7,5.46 21.34,4.95 31.62,4.95 32.77,6.22 v32.77,7.24 | v35.69,22.23 35.69,24.77 34.92,25.53 34.04,25.53 33.53,26.04 32,26.04 31.24,26.8 v31.24,27.64 | v32.62,27.64 32.85,27.41 U$4.24 | v38.86,7.87 v38.86,11.43 | L1.2 47.37,18.29 v47.12,18.54
  Bottom 0.406: v35.69,22.23 40.39,22.1 41.27,21.46 46.48,21.46 46.99,20.7 47.12,20.57 v47.12,18.54 44.9,16.32 C4.1 44.9,14.29 43.94,13.34 39.62,13.34 38.86,12.57 v38.86,11.43 | v9.05,42.23 v11.11,44.29 | v12.54,16.35 18.13,16.35 18.76,15.72 21.05,15.72 22.13,14.64 22.13,12.22 21.21,10.92 v20.7,10.92 17.02,10.92 v15.88,12.06 | v31.24,27.64 v32.62,27.64 | v32.77,7.24 33.4,7.87 v38.86,7.87 | U$7.4 13.45,9.67 14.35,8.76 14.35,8.38 14.67,8.07 C14.1 v15.24,6.35
D6*  (via drill 0.41)
  Top 0.203: v4.32,45.09 4.32,46.23 3.94,46.23 3.97,49.05 v3.81,49.05 | v24.99,38.7 24.7,39.12 24.7,46.42 18.95,51.91 v15.08,51.91 | 34.61,29.84 U$4.27 34.69,29.84 33.4,29.84 33.18,29.62 v32.67,29.62
  Bottom 0.203: R8.2 3.24,45.09 v4.32,45.09 | v15.08,51.91 11.75,51.91 8.57,48.74 4.13,48.74 v3.81,49.05 | v32.67,29.62 32.67,31.34 31.15,32.86 30.32,32.86 24.99,38.32 v24.99,38.7
D8*  (via drill 0.41)
  Top 0.203: S1.2 3.3,54.99 v2.79,54.48 | v8.57,46.99 8.41,47.15 v8.41,49.53 | U$4.28 34.61,30.64 32.71,30.64 32.69,30.66 32.3,30.66 v31.91,31.05
  Bottom 0.203: v2.79,54.48 2.79,53.09 4.63,51.25 R11.1 4.76,50.8 7.14,50.8 v8.41,49.53 | v31.91,31.05 31.75,30.96 14.95,30.96 14.32,31.59 6.76,31.59 4.06,34.29 4.06,36.58 4.7,37.34 5.71,37.34 6.6,38.23 6.6,39.75 6.1,40.26 4.83,40.26 4.32,40.77 4.32,42.04 4.57,42.29 5.21,42.29 6.6,43.69 6.6,44.32 8.57,46.29 v8.57,46.99
D9*  (via drill 0.41)
  Top 0.203: v8.51,50.55 8.89,50.04 9.27,50.04 | v32.54,33.47 32.54,31.81 32.99,31.37 34.69,31.37 U$4.29 34.61,31.43 | v28.57,39.37 28.83,39.75 28.83,49.72 v24.57,53.98
  Bottom 0.203: v8.51,50.55 9.08,50.99 R10.2 9.13,52.97 | v32.54,33.47 32.54,35.4 v28.57,39.37 | 9.21,53.18 9.13,52.97 | v24.57,53.98 17.08,53.98 15.18,55.88 11.18,55.88 10.67,55.37 10.67,54.13 9.5,52.97 9.13,52.97
D10*  (via drill 0.41)
  Top 0.203: v37.94,32.07 34.77,32.07 U$4.30 | v40.8,30.96 42.07,32.23 v42.07,32.54 | v40.48,34.13 39.21,35.4 39.21,43.5 45.09,49.37 v45.09,56.04 | v34.86,56.67 22.26,56.67 v20.13,54.67 18.03,52.58 13.08,52.58
  Bottom 0.203: v37.94,32.07 39.05,30.96 v40.8,30.96 | v40.48,34.13 v42.07,32.54 | v45.09,56.04 44.45,56.67 v34.86,56.67 | R12.1 9.66,54.86 11.03,56.24 15.39,56.24 16.89,54.74 20.07,54.74 v20.13,54.67
D+USB
  Top 0.203: X4.3 10.79,10.79 12.06,12.06 R24.2
D-USB
  Top 0.203: R31.2 10.16,12.06 10.16,9.53 X4.2
DVCC  (via drill 0.41)
  Top 0.203: U$3.14 48.9,45.09 46.99,43.18 v46.99,39.05 46.99,33.48 R14.2 46.48,32.46 46.48,21.65 47.31,20.83 51.31,20.83 51.75,21.27 51.88,25.65 55.22,28.99 C19.2 | U$4.14 26.67,25.4 26.67,30.73 v25.4,31.75 25.15,31.75 24.77,32.13 24.77,33.02 24.13,33.66 23.5,33.66 U$4.2 | v37.15,39.37 35.24,41.27 35.24,44.07 33.08,46.23 31.24,46.23 30.86,45.85 30.86,37.72 31.11,37.47 32.64,37.47 32.93,37.17 U$4.34 33.02,36.2 33.02,35.56 32.38,34.92 28.57,34.92 v27.3,33.66
  Top 0.406: v4.57,5.02 0.64,9.21 0.64,43.43 1.33,44.01 4.57,44.01 5.84,45.4 v8.89,45.4 | v27.3,23.24 26.53,24.02 U$4.14 | v37.78,1.59 37.78,3.17 39.62,5.14 40.06,5.58 U$8.P1 | v28.83,23.24 28.96,23.11 28.96,20.57 29.21,20.32 29.84,20.32 30.35,19.81 30.35,13.72 32.38,11.68 v34.42,11.68 | v40.89,14.22 42.29,15.62 L2.2
  Bottom 0.203: R12.2 R10.1 | v25.4,31.75 v27.3,33.66 | v46.99,39.05 46.67,39.37 v37.15,39.37 | 2.67,50.99 R11.2 | 2.79,47.5 R8.1 2.73,47.11
  Bottom 0.406: R12.2 5.33,54.86 4.19,56.01 2.67,56.01 1.97,55.31 1.97,52.51 2.67,51.94 2.67,50.99 | 3.05,47.82 9.53,47.82 11.18,46.29 11.18,45.59 10.99,45.4 v8.89,45.4 | 3.05,47.82 2.8,47.94 2.73,48.01 | v37.78,1.59 37.34,1.91 7.94,1.91 4.95,5.02 v4.57,5.02 | R11.2 2.73,48.13 | 2.73,48.13 2.73,48.01 | 2.73,48.01 2.73,47.63 | 2.73,47.63 2.73,47.11 | 3.05,47.82 2.73,47.63 | 3.05,47.82 2.73,48.13 | v28.83,23.24 v27.3,23.24 | U$8.P1 40.01,6.11 40.01,8.26 37.85,10.41 37.85,11.43 37.34,11.94 | v40.89,14.22 40.19,14.93 R15.2 38.84,13.95 37.34,12.45 | 37.02,12.25 C6.1 34.99,12.25 v34.42,11.68 | 37.34,11.94 37.02,12.25 | 37.34,12.45 37.15,12.25 37.02,12.25 | 37.34,12.45 37.34,11.94
ENREF  (via drill 0.41)
  Top 0.203: U$4.25 35.57,28.21 v37.21,29.84 | 38.9,28.32 v38.73,28.32 39.43,28.32 40.44,27.3 40.44,23.75 38.23,21.53 v38.23,20.32 | v13.34,10.67 13.34,12.45 v13.72,12.83 | v17.14,14.1 21.08,14.1 23.5,11.68 23.72,11.68 v23.88,11.53
  Bottom 0.203: v37.21,29.84 v38.73,28.32 | 28.73,15.24 30.81,17.32 32.94,19.48 33.27,19.81 34.61,19.81 35.56,20.76 37.79,20.76 v38.23,20.32 | 28.73,15.24 28.7,15.24 | 28.73,15.24 28.73,15.01 26.67,12.95 25.02,12.95 23.88,11.81 v23.88,11.53 | U$7.3 9.92,9.67 10.92,10.67 v13.34,10.67 | v13.72,12.83 14.22,12.83 15.49,14.1 v17.14,14.1
GND  (via drill 0.41)  (33 unrouted)
  Top 0.203: 7.11,51.31 S2.1 9.91,51.31 S3.1 | 24.13,15.88 24.55,16.04 | 24.55,16.04 C2.1 25.07,16.51 v26.54,16.51 | U$5.3 1.91,30.35 1.91,23.04 U$9.3 | 34.92,26.67 U$4.23 | C8.1 35.56,15.88 36.32,16.64 v36.32,20.07 | 40.01,52.7 Q5.3 39.93,53.67 38.73,54.86 v37.97,54.86 | U$4.43 25.88,36.35 25.88,35.56 26.04,35.4 32.07,35.4 32.07,36.35 U$4.35 | 12.54,9.05 X4.5 | 10.57,42.07 10.48,42.07 C5.2 10.47,40.31 v10.16,40.01 | IC1.2 11.48,29.52 v12.45,30.48 | v25.91,30.3 25.86,30.35 25.02,30.35 25.02,30.48 24.13,31.37 23.17,31.37 U$4.5 21.75,31.41 21.44,31.09 20.17,31.09 20.07,30.99 19.43,31.62 19.43,32.89 21.21,34.67 21.21,47.37 v20.45,48.01 | v34.24,13.08 34.24,15.21 34.8,15.77 | 24.14,15.63 24.55,16.04 | v23.24,7.62 25.53,7.62 | 25.53,7.62 25.78,7.62 | 25.78,7.62 25.78,7.87 | 25.78,7.87 25.78,9.4 24.26,10.92 v22.73,10.92 | v39.5,19.68 SJ3.1 | v31.5,7.62 26.04,7.62 | 26.04,7.62 25.78,7.62 | 25.78,7.87 26.04,7.62 | 25.78,7.87 25.53,7.62
  Top 0.305: 25.74,36.45 U$4.43
  Top 0.406: 55.88,21.59 X1.G@2 56.52,20.95 v56.52,19.68 | v56.52,14.61 56.52,13.34 X1.G@1 v56.49,10.92 | v50.85,4.14 44.58,4.14 v43.63,5.08
  Bottom 0.203: 3.81,15.88 CON1.GND 4.79,14.9 4.79,14.15 5.26,13.68 5.5,13.68 6.6,12.57 v7.75,12.57 | 12.7,14.61 C7.1 12.54,14.92 12.53,14.91 | v17.91,14.99 15.62,14.99 14.99,14.35 v13.81,14.35 | 42.55,19.68 C10.2 | v56.52,19.68 56.52,20.95 X1.G@2 | v56.52,14.61 56.52,13.34 X1.G@1 | 4.13,15.08 4.14,15.03 | v10.16,40.01 10.16,38.07 v7.64,35.54 | v25.91,30.3 27,29.21 v27.56,29.21 | v37.97,54.86 37.34,54.86 36.83,55.37 32.77,55.37 v32.38,54.99 | v20.45,48.01 v18.29,50.55 | U$8.P4 34.02,6.1 31.75,6.1 31.5,6.35 v31.5,7.62 32.13,8.26 32.89,8.26 34.8,10.16 | 22.61,6.22 JP4.8 22.73,6.22 23.24,6.73 v23.24,7.62 | C10.2 39.82,20.01 v39.5,19.68 36.7,19.68 v36.32,20.07 | v22.73,10.92 22.99,11.18 22.99,14.48 25.02,16.51 v26.54,16.51 | 34.8,10.16 34.99,10.35 | 34.99,10.35 C6.2 | v34.24,13.08 33.91,13.08 33.27,12.45 33.27,11.05 33.97,10.35 34.54,10.35 | 34.54,10.35 34.99,10.35 | 34.54,10.35 34.74,10.16 34.8,10.16 | C10.2 42.72,17.83 C9.2
  Bottom 0.406: v56.52,19.68 v56.52,14.61 | v56.49,10.92 55.75,10.92 55.39,10.56 X5.2 56.78,8.26 57.78,8.26 57.99,8.05 57.99,4.7 57.6,4.18 57.55,4.14 v50.85,4.14 | U$8.P4 34.04,6.02 34.04,4.45 34.42,4.06 41.66,4.06 42.67,5.08 v43.63,5.08 44.05,5.08 U$1.P3
  other vias: 33.27,44.96 32,47.5 15.75,45.09 8.26,10.67
  pour Bottom: 0,0 17.27,0 17.27,31.5 59.18,31.5 59.18,58.04 0,58.04
  pour Top: 0,0 23.5,0 23.5,9.02 31.5,9.02 31.5,5.59 33.4,5.59 33.4,10.67 25.15,10.67 25.15,12.06 23.5,13.72 23.5,14.99 18.92,14.99 18.92,21.59 33.78,21.59 33.78,14.99 38.23,14.99 38.23,20.07 59.18,20.07 59.18,58.04 0,58.04
HWB
  Top 0.203: U$4.33 34.73,37.66 33.3,39.09 R3.2 32.74,39.65
IEXC+
  Top 0.203: IC2.7 15.88,17.78 17.4,17.78 17.78,17.4 17.78,16.51 17.27,16 16.76,16 16.38,15.62 16.38,13.08 16.64,12.83 17.78,12.83 18.54,12.06 20.83,12.06 21.72,11.18 21.72,10.67 22.23,10.16 23.11,10.16 JP4.5
IEXC-  (via drill 0.41)
  Top 0.203: 13.97,20.32 13.97,20.95 15.24,22.23 15.24,23.5 16.51,24.77 R7.2 | 13.97,20.32 15.24,19.05 IC2.6 | 13.97,20.32 13.97,16 14.99,14.99 14.99,11.68 15.62,11.05 16.13,11.05 16.79,10.39 16.79,6.76 v16.76,6.73
  Bottom 0.203: JP4.6 24.51,5.21 24.13,4.83 18.92,4.83 18.16,5.59 18.16,6.22 17.65,6.73 v16.76,6.73
ISP+5V  (via drill 0.41)
  Top 0.203: v2.29,9.78 8.89,3.17 8.89,1.27 9.53,0.64 17.91,0.64 22.23,4.45 30.35,4.45 30.73,4.06 30.73,1.78 32,0.51 43.94,0.51 44.45,1.02 44.45,3.56 43.69,4.32 43.43,4.32 42.93,4.83 42.93,9.14 44.7,10.92 44.7,17.65 44.45,17.91 v44.45,18.29
  Bottom 0.203: CON1.5V 3.81,18.41 1.91,16.51 1.91,10.16 v2.29,9.78 | D2.A 45.52,19.1 v44.45,18.29
MISO  (via drill 0.41)
  Top 0.203: v13.97,22.86 15.88,24.77 15.88,36.83 16.51,37.47 18.41,37.47 | 18.41,37.47 18.41,30.48 22.23,26.67 22.86,26.67 U$4.11 | v19.18,45.97 18.41,45.21 18.41,37.47
  Bottom 0.203: v13.97,22.86 9.53,22.86 5.08,18.41 CON1.MISO | v19.18,45.97 28.07,45.97 28.43,46.46 29.31,46.5 | 29.21,46.35 29.31,46.5 | 29.31,46.5 IC4.P$13
MOSI  (via drill 0.41)
  Top 0.203: v3.81,12.95 4.45,13.59 4.45,17.78 6.22,19.68 6.22,23.75 5.59,24.51 v5.59,26.42 | v25.4,27.3 23.5,27.3 U$4.10 | v17.78,47.62 17.78,47.37 16.51,46.23 16.51,42.55 16,41.91 16,37.85 15.24,37.08 15.24,26.67 v14.61,26.04
  Bottom 0.203: v25.4,27.3 24.13,26.04 v14.61,26.04 7.49,26.04 7.11,26.42 v5.59,26.42 | CON1.MOSI 3.81,17.14 2.29,15.88 2.29,13.59 2.92,12.95 v3.81,12.95 | v17.78,47.62 17.78,46.35 19.05,45.09 29.21,45.09 IC4.P$14
N$1  (via drill 0.41)
  Top 0.203: L2.1 42.29,10.67 v42.67,10.29 | L1.1 47.37,13.84 v48.39,14.86 49.15,14.86 49.53,15.24 49.53,16.76 51.44,18.67 F1.2
  Bottom 0.203: v42.67,10.29 44.32,11.94 47.37,11.94 48.39,12.95 v48.39,14.86
N$2  (1 unrouted)
N$3
  Top 0.203: U$3.8 49.15,35 R14.1
NSS  (via drill 0.41)
  Top 0.203: U$4.31 33.8,33.01 33.4,33.4 33.4,35.05 33.91,35.56 33.91,37.47 33.53,37.85 31.57,37.85 31.24,38.17 31.24,43.43 31.57,43.77 v31.57,44.65
  Bottom 0.203: IC4.P$15 30.69,42.88 31.57,43.77 v31.57,44.65
ONE-WIRE  (via drill 0.41)
  Top 0.203: 34.92,33.66 U$4.32 35.71,33.81 36.2,34.29 36.2,39.82 34.89,41.13 34.89,43.22 v34.29,43.81 | v3.81,11.43 2.16,12.95 2.16,20.32 3.94,21.59 U$9.2 3.94,22.99 3.3,23.62 3.3,29.97 3.91,30.71 U$5.2 3.91,31.52 3.17,32.26 3.17,38.1 U$6.2 3.81,39.12 3.81,40.77 4.32,41.27 v5.46,41.27 | v8.76,43.94 9.78,43.94 11.05,45.21 14.04,45.21 15.24,46.41 v15.24,46.99
  Bottom 0.203: R17.2 15.88,13.34 14.22,11.68 | JP4.10 17.91,7.62 17.53,7.62 17.14,8 17.14,10.15 15.86,11.43 14.48,11.43 | v15.24,46.99 15.88,46.99 19.05,43.81 30.73,43.81 30.86,43.94 30.86,45.47 31.11,45.72 32.13,45.72 32.38,45.47 32.38,44.2 32.77,43.81 v34.29,43.81 | v8.76,43.94 6.1,41.27 v5.46,41.27 | 14.22,11.68 13.97,11.43 | 13.97,11.43 v3.81,11.43 | 14.48,11.43 13.97,11.43 | 14.22,11.68 14.48,11.43
RD_N  (via drill 0.41)
  Top 0.203: v4.95,35.81 4.95,33.91 7.75,31.24 7.75,16.51 9.53,14.61 R31.1 | v17.14,41.91 17.78,42.55 17.78,46.23 18.92,47.37 18.92,47.87 19.94,48.89 20.62,48.89 21.59,47.92 21.59,33.66 22.23,33.02 22.86,33.02 U$4.3
  Bottom 0.203: v4.95,35.81 7.75,38.61 8.51,38.61 9.27,39.37 9.27,40.77 10.41,41.91 v17.14,41.91
RD_P  (via drill 0.41)
  Top 0.203: v6.22,33.78 8.26,31.75 8.26,18.41 12.06,14.61 R24.1 | v20.32,31.75 21.59,31.75 22.23,32.38 22.86,32.38 U$4.4
  Bottom 0.203: v6.22,33.78 7.62,32.38 14.61,32.38 15.24,31.75 v20.32,31.75
RST  (via drill 0.41)
  Top 0.203: v52.07,48.26 52.07,52.7 RRST.2 51.44,52.86 51.44,56.67 v50.8,57.31 | v15.72,47.94 16.03,48.26 16.03,49.72 v16.1,49.78 | v23.11,20.13 25.56,22.45 25.56,24.61 25.72,24.77 U$4.13 | v13.18,17.94 13.49,17.62 13.49,15.88 14.61,14.76 14.61,12.7 13.97,12.06 13.97,4.7 13.46,4.19 11.11,4.19 v10.41,3.49 | v43.91,27.46 44.61,26.77 44.61,19.68 43.27,18.35 41.72,18.35 | v43.05,3.02 42.83,3.02 41.78,4.06 41.78,9.78 41.4,10.16 40.63,10.16 40.07,10.73 40.07,18.23 v40.13,18.41 41.66,18.41 41.72,18.35 | 41.72,18.35 SJ3.2
  Bottom 0.203: v52.07,48.26 52.7,47.62 53.34,47.62 U1.32 | v15.72,47.94 14.61,47.94 13.65,46.99 IC4.P$4 | v13.18,17.94 17.14,21.91 20.95,21.91 21.91,20.95 22.61,20.95 23.11,20.45 v23.11,20.13 | v43.91,27.46 49.69,27.46 52.55,24.61 55.59,24.61 55.88,24.89 55.88,25.02 55.91,52.93 52.86,55.72 52.39,55.72 v50.8,57.31 50.48,57.63 34.61,57.63 33.34,56.36 28.1,56.36 24.92,53.18 18.1,53.18 16.1,51.18 v16.1,49.78 | v43.05,3.02 42.89,3.02 42.67,2.79 11.11,2.79 v10.41,3.49 9.46,4.45 7.24,4.45 3.05,8.64 3.05,11.81 3.43,12.19 5.21,12.19 5.61,11.79 8.38,11.79 8.76,12.17 8.76,12.83 5.84,15.75 CON1.RESET | C9.1 41.99,14.91 40.07,16.82 R15.1 38.84,17.12 v40.13,18.41
RX  (via drill 0.41)
  Top 0.203: 51.05,41.4 51.05,34.16 50.81,33.92 50.81,32.88 52.2,31.5 52.2,28.07 v48.26,24.13 | 51.05,41.4 51.05,41.78 | 51.05,41.78 51.05,42.55 50.09,43.51 U$3.13 | U$4.20 31.33,24.17 31.77,23.72 32.15,23.34 33.05,23.34 34.04,22.35 34.04,21.97 v34.16,21.84 | U$3.12 50.22,42.24 50.67,41.78 | 50.67,41.78 50.86,41.59 | 50.86,41.59 51.05,41.4 | 50.86,41.59 51.05,41.78 | 50.67,41.78 51.05,41.78
  Bottom 0.203: v34.16,21.84 35.05,23.11 40.13,23.11 41.15,24.13 v48.26,24.13
RX2  (via drill 0.41)
  Top 0.203: U$3.3 41.83,42.24 v41.15,42.93 | v46.1,41.66 v46.1,34.29
  Bottom 0.203: v41.15,42.93 42.42,41.66 v46.1,41.66 | v46.1,34.29 46.1,33.02 47.75,31.37 JP5.3
RX3  (via drill 0.41)
  Top 0.203: v42.55,34.92 44.45,36.83 44.45,42.67 43.61,43.51 U$3.2
  Bottom 0.203: v42.55,34.92 36.2,34.92 U1.6
SCK  (via drill 0.41)
  Top 0.203: v40.26,41.27 39.62,40.77 39.62,35.94 41.27,34.42 41.27,32.38 38.73,29.84 38.1,29.07 v38.1,25.78 | v18.1,26.83 17.94,26.67 v17.94,21.11 | 23.02,28.26 U$4.9 21.64,28.21 v20.8,29.05
  Bottom 0.203: 5.08,17.14 CON1.SCK 6.35,17.02 8.32,15.05 8.32,13.78 8.76,13.34 10.41,13.34 10.79,13.72 10.79,16.76 11.18,17.14 13.46,17.14 17.43,21.11 v17.94,21.11 17.97,21.08 20.95,21.08 23.88,18.16 29.59,18.16 32.26,20.83 32.26,21.34 33.27,22.35 33.27,25.27 33.78,25.78 v38.1,25.78 | IC4.P$12 29.84,48.9 34.29,53.34 37.47,53.34 37.47,47.62 40.26,44.83 v40.26,41.27 | v18.1,26.83 18.41,26.51 20.16,26.51 20.7,27.05 20.7,28.96 v20.8,29.05
SCL  (via drill 0.41)
  Top 0.203: 29.84,24.77 U$4.18 29.73,24.25 30.53,23.45 30.99,23.45 32,22.43 v32,22.1 | v22.1,21.84 22.1,25.53 17.78,29.84 17.78,35.56 R9.2 | U$8.P2 38.06,7.02 36.96,8.13 34.8,8.13 29.21,13.72 v29.21,19.18
  Bottom 0.203: v22.1,21.84 22.48,21.46 22.99,21.46 24.26,20.19 28.96,20.19 | 28.96,20.19 29.21,20.19 | 29.21,20.19 29.46,20.19 | 29.46,20.19 30.1,20.19 v32,22.1 | v29.21,19.18 29.21,19.94 | 29.21,19.94 29.21,20.19 | 28.96,20.19 29.21,19.94 | 29.21,19.94 29.46,20.19
SDA  (via drill 0.41)
  Top 0.203: v30.48,33.66 30.48,25.4 U$4.19 | v17.14,40.64 17.14,39.37 R2.1 | U$4.19 30.48,24.77 | U$4.19 30.53,24.25 30.98,23.8 31.19,23.8 31.52,23.47 31.8,23.2 31.8,23.19 32,22.99 32.26,22.99 33.02,22.35 v33.15,21.08 | U$8.P3 36.06,7.36 36.07,7.37 35.69,7.75 34.67,7.75 31.68,10.74 29.14,10.74 28.57,11.3 26.92,11.3 26.29,11.81 26.29,14.73 26.8,15.24 v27.05,15.24
  Bottom 0.203: v30.48,33.66 30.48,36.2 26.67,40.01 17.78,40.01 v17.14,40.64 | v27.05,15.24 27.3,15.24 v33.15,21.08
TX  (via drill 0.41)
  Top 0.203: U$4.21 32.13,23.88 32.26,23.75 33.23,23.75 35.41,21.57 36.09,21.57 36.47,21.95 36.47,22.78 v37.34,23.77 | 50.67,39.5 50.67,40.51 50.22,40.97 U$3.11 | 50.67,39.5 50.67,39.12 | 50.67,39.12 50.67,34.42 50.67,34.29 49.02,32.64 49.02,26.16 48.14,25.27 v47.75,25.27 | U$3.10 50.09,39.7 50.29,39.5 | 50.29,39.5 50.42,39.37 | 50.42,39.37 50.67,39.12 | 50.55,39.5 50.29,39.5 | 50.67,39.5 50.55,39.5 | 50.55,39.5 50.42,39.37
  Bottom 0.203: v37.34,23.77 40.15,23.77 40.89,24.51 46.74,24.51 v47.75,25.27
TX2  (via drill 0.41)
  Top 0.203: U$3.5 42.11,39.7 41.4,38.99 41.4,35.2 41.65,34.95 41.65,34.68 v43.94,32.38
  Bottom 0.203: v43.94,32.38 45.21,31.11 JP5.2
TX3  (via drill 0.41)
  Top 0.203: v40.64,36.2 40.64,39.62 42.04,41.02 42.09,40.97 U$3.4
  Bottom 0.203: v40.64,36.2 36.2,36.2 U1.7
UCAP  (via drill 0.41)
  Top 0.203: v20.32,46.86 20.32,46.23 19.05,44.7 19.05,31.24 19.81,30.48 22.86,30.48 U$4.6 | 26.67,43.81 C3.2 26.67,44.77 26.67,46.61 26.16,47.12 v25.91,47.12
  Bottom 0.203: v25.91,47.12 25.65,46.86 v20.32,46.86
V_USB  (via drill 0.41)
  Top 0.203: U$4.7 23.5,29.84 24.77,29.84 25.4,29.21 v25.4,28.57 | 9.37,8.73 9.24,8.86 | 9.24,8.86 9.21,8.89 X4.1 | v4.45,10.64 6.64,12.7 6.64,24.35 6.38,24.61 v6.38,25.11 | v10.32,5.05 10.32,6.06 9.14,7.24 9.14,8.76 9.24,8.86
  Bottom 0.203: 27.56,24.38 27.3,24.13 25.91,24.13 25.65,23.88 25.65,22.48 24.51,21.34 23.75,21.34 22.23,22.86 15.88,22.86 10.16,17.14 10.16,15.24 9.84,14.92 C7.2 | 27.56,24.38 27.78,24.61 | 27.78,24.61 28.32,25.15 | 28.32,25.15 28.57,25.4 | 28.57,25.4 28.83,25.65 | 28.83,25.65 29.84,26.54 38.61,26.54 39.5,25.78 46.82,25.78 47.23,26.18 48.66,26.18 49.53,25.44 49.53,21.97 50.7,20.8 D4.A | 28.57,25.4 28.32,25.65 | 28.32,25.65 v25.4,28.57 | v10.32,5.05 9.21,5.08 7.94,5.08 3.65,9.37 3.65,10.13 4.16,10.64 v4.45,10.64 | 28.32,25.65 28.32,25.15 | 28.32,25.65 28.83,25.65 | 27.34,24.61 7.14,24.61 6.64,25.11 v6.38,25.11 | 27.34,24.61 27.78,24.61 | 27.56,24.38 27.34,24.61
VCC  (via drill 0.41)
  Top 0.203: 13.65,28.89 IC1.1 13.74,28.68 | v7.3,36.83 7.3,41.59 7.62,41.91 C5.1 | v12.7,26.92 13.65,28.26 13.65,28.57 13.74,28.68 | 13.72,28.71 13.74,28.68 | 13.95,28.89 13.84,28.79 | v13.84,34.16 13.84,28.79 | 13.84,28.79 13.74,28.68
  Top 0.406: v52.32,3.11 52.32,10.35 50.23,12.45 50.23,14.78 F1.1 52.39,15.8 v52.39,16.95 v52.39,16.94
  Bottom 0.203: 42.55,22.23 42.65,22.27 42.69,22.27 C10.1 42.86,22.54 | 48.26,19.68 48.29,19.71 D2.C | v7.3,36.83 6.35,35.88 6.35,34.92 8.26,33.02 12.7,33.02 v13.84,34.16 | v12.7,26.92 7.87,26.92 7.49,27.18 2.29,27.18 1.27,26.16 1.27,9.53 8.26,2.41 38.16,2.41 38.48,2.22 48.45,2.22 49.59,3.11 v52.32,3.11
  Bottom 0.406: 47.88,22.18 D3.C | D3.C 47.62,22.86 43.18,22.86 42.86,22.54 | v52.32,3.11 57.85,3.11 58.55,3.81 58.55,8.87 57.77,9.65 X5.1 | D3.C 48.29,22.27 48.29,19.71 | D2.C 50.7,17.68 D4.C | v52.39,16.95 50.89,16.95 D4.C | D4.C 50.16,17.14 49.4,16.38 49.4,10.92 J1.2
VDD
  Bottom 0.203: D3.A 51.44,22.23 51.44,21.59 53.66,19.37 53.66,13.97 50.42,10.86 50.42,6.35 50.12,6.05 U$1.P1
VEXC  (2 unrouted)
  Top 0.203: 20.95,16.51 20.95,17.78 IC2.2
VOPA  (via drill 0.41)  (6 unrouted)
  Top 0.203: v39.21,21.11 40.93,22.83 40.93,28.29 v39.91,29.3 | U$4.26 34.77,29.05 35.72,29.05 36.2,29.53 36.2,30.48 36.7,30.99 v37.4,30.99
  Bottom 0.203: 25.24,13.94 25.75,14.45 27.59,14.45 27.81,14.67 27.81,15.11 32.89,20.19 34.42,20.19 35.34,21.11 v39.21,21.11 | 37.59,30.99 v37.4,30.99 38.23,30.99 v39.91,29.3
VOUT+  (via drill 0.41)
  Top 0.203: U$4.41 27.33,47.22 21.72,52.83 v21.72,55.12 | v28.32,3.81 28.32,3.41 v25.91,1.12
  Bottom 0.203: v21.72,55.12 20.24,56.59 2.46,56.59 1.14,55.27 1.14,26.79 0.91,26.44 0.91,7.72 7.24,1.4 25.53,1.4 v25.91,1.12 | v28.32,3.81 28.32,8.26 27.81,8.76 JP4.3
VOUT-  (via drill 0.41)
  Top 0.203: U$4.40 28.13,37.53 27.69,37.97 27.69,47.37 23.37,51.68 v23.37,55.24 | v26.54,3.81 26.54,3.17 24.13,0.76 23.11,0.76 v22.35,0.76
  Bottom 0.203: v23.37,55.24 21.67,56.95 2.31,56.95 | v22.35,0.76 7.11,0.76 0.51,7.37 0.51,26.54 0.76,26.92 0.76,55.37 0.79,55.4 0.79,55.42 2.31,56.95 | JP4.4 27.05,4.32 v26.54,3.81 | 2.31,56.95 2.59,56.95 | 2.31,56.95
VREF  (via drill 0.35)  (2 unrouted)
  Top 0.203: 15.88,20.32 IC2.5 17.14,20.45 18.41,19.18 | v25.79,10.47 25.27,10.98 25.27,13.21 24.13,14.35 23.37,14.35 22.86,14.86 22.76,14.97 22.76,18.52 22.1,19.18
  Bottom 0.203: U$7.5 11.68,8.3 11.68,5.97 13.08,4.57 C13.1 14.8,3.97 15.24,3.53 24.36,3.53 25.78,4.95 25.78,9.78 | JP4.1 29.34,8.76 28.07,10.03 26.04,10.03 | v25.79,10.47 v25.78,10.46 25.78,10.29 | 25.78,9.78 25.78,10.03 | 25.78,10.03 25.78,10.29 | 26.04,10.03 25.78,10.03 | 26.04,10.03 25.78,9.78 | 26.04,10.03 25.78,10.29
VREF/2  (1 unrouted)
  Bottom 0.203: U$7.1 8.05,8.37 C12.1
VSENSORS  (via drill 0.35, 0.41)
  Top 0.203: v24.13,22.23 24.13,24.13 24.77,24.77 U$4.12 | 5.21,30.73 5.48,30.5 | 5.48,30.5 7.11,29.08 7.11,11.43 7.62,10.92 7.62,4.95 9.53,3.05 9.53,1.78 10.03,1.27 17.14,1.27 18.16,2.29 v18.16,9.78 17.78,10.16 v17.78,11.81 | U$6.1 3.68,37.34 3.68,33.15 5.18,31.65 U$5.1 5.18,30.76 5.21,30.73 | 5.02,30.54 4.45,29.97 4.45,24 5.21,23.24 U$9.1 | 5.02,30.54 5.21,30.73 | 5.02,30.54 5.43,30.54 5.48,30.5
  Bottom 0.203: v24.13,22.23 22.23,24.13 5.84,24.13 5.26,23.42 U$9.1 | v17.78,11.81 19.81,11.81 20.38,12.38 20.38,13.08 R17.1 | JP4.9 18.41,9.78 v18.16,9.78
XTAL1
  Top 0.203: U$4.17 28.93,24.16 30.28,22.81 R13.2 32.28,19.81 X3.P$2 32.61,18.57 C8.2
XTAL2
  Top 0.203: C2.2 24.77,19.05 26.67,19.05 X3.P$1 27.12,18.94 | 27.3,19.05 27.12,18.94 | U$4.16 28.13,22.52 R13.1 27.43,19.25 27.12,18.94

### Text on the board
tNames: StandTransducer V0.1 | GND | DQ | VCC | GND | DQ | VCC | GND | DQ | VCC | 1
Document: Standard Tranducer Version 0.1 | This Designs ARE PROVIDED "AS IS" AND "WITH ALL FAULTS. Andres Vargas DISCLAIMS ALL / OTHER WARRANTIES, EXPRESS OR IMPLIED, REGARDING PRODUCTS, INCLUDING BUT / NOT LIMITED TO, ANY IMPLIED WARRANTIES OF MERCHANTABILITY OR FITNESS FOR A / PARTICULAR PURPOSE. | Universidad del Valle may make changes to specifications and product descriptions at any time, / without notice. The Customer must not rely on the absence or characteristics of any features or / instructions marked "reserved" or "undefined." Andres Vargas reserves these for future definition / and shall have no responsibility whatsoever for conflicts or incompatibilities arising from future / changes to them. The product information or Materials is subject to change without notice. Do not / finalize a design with this information.
Reference: This designs was developed under undergraduate thesis from Andres Vargas in the School of / Electrical and Electronic Engineering of Universidad del Valle, Cali - Colombia. 2018.